# EAGLE schematic hw_LM (EAGLE 7.6.0), part 1 of 3

## Sheet 1 of 9: Connector
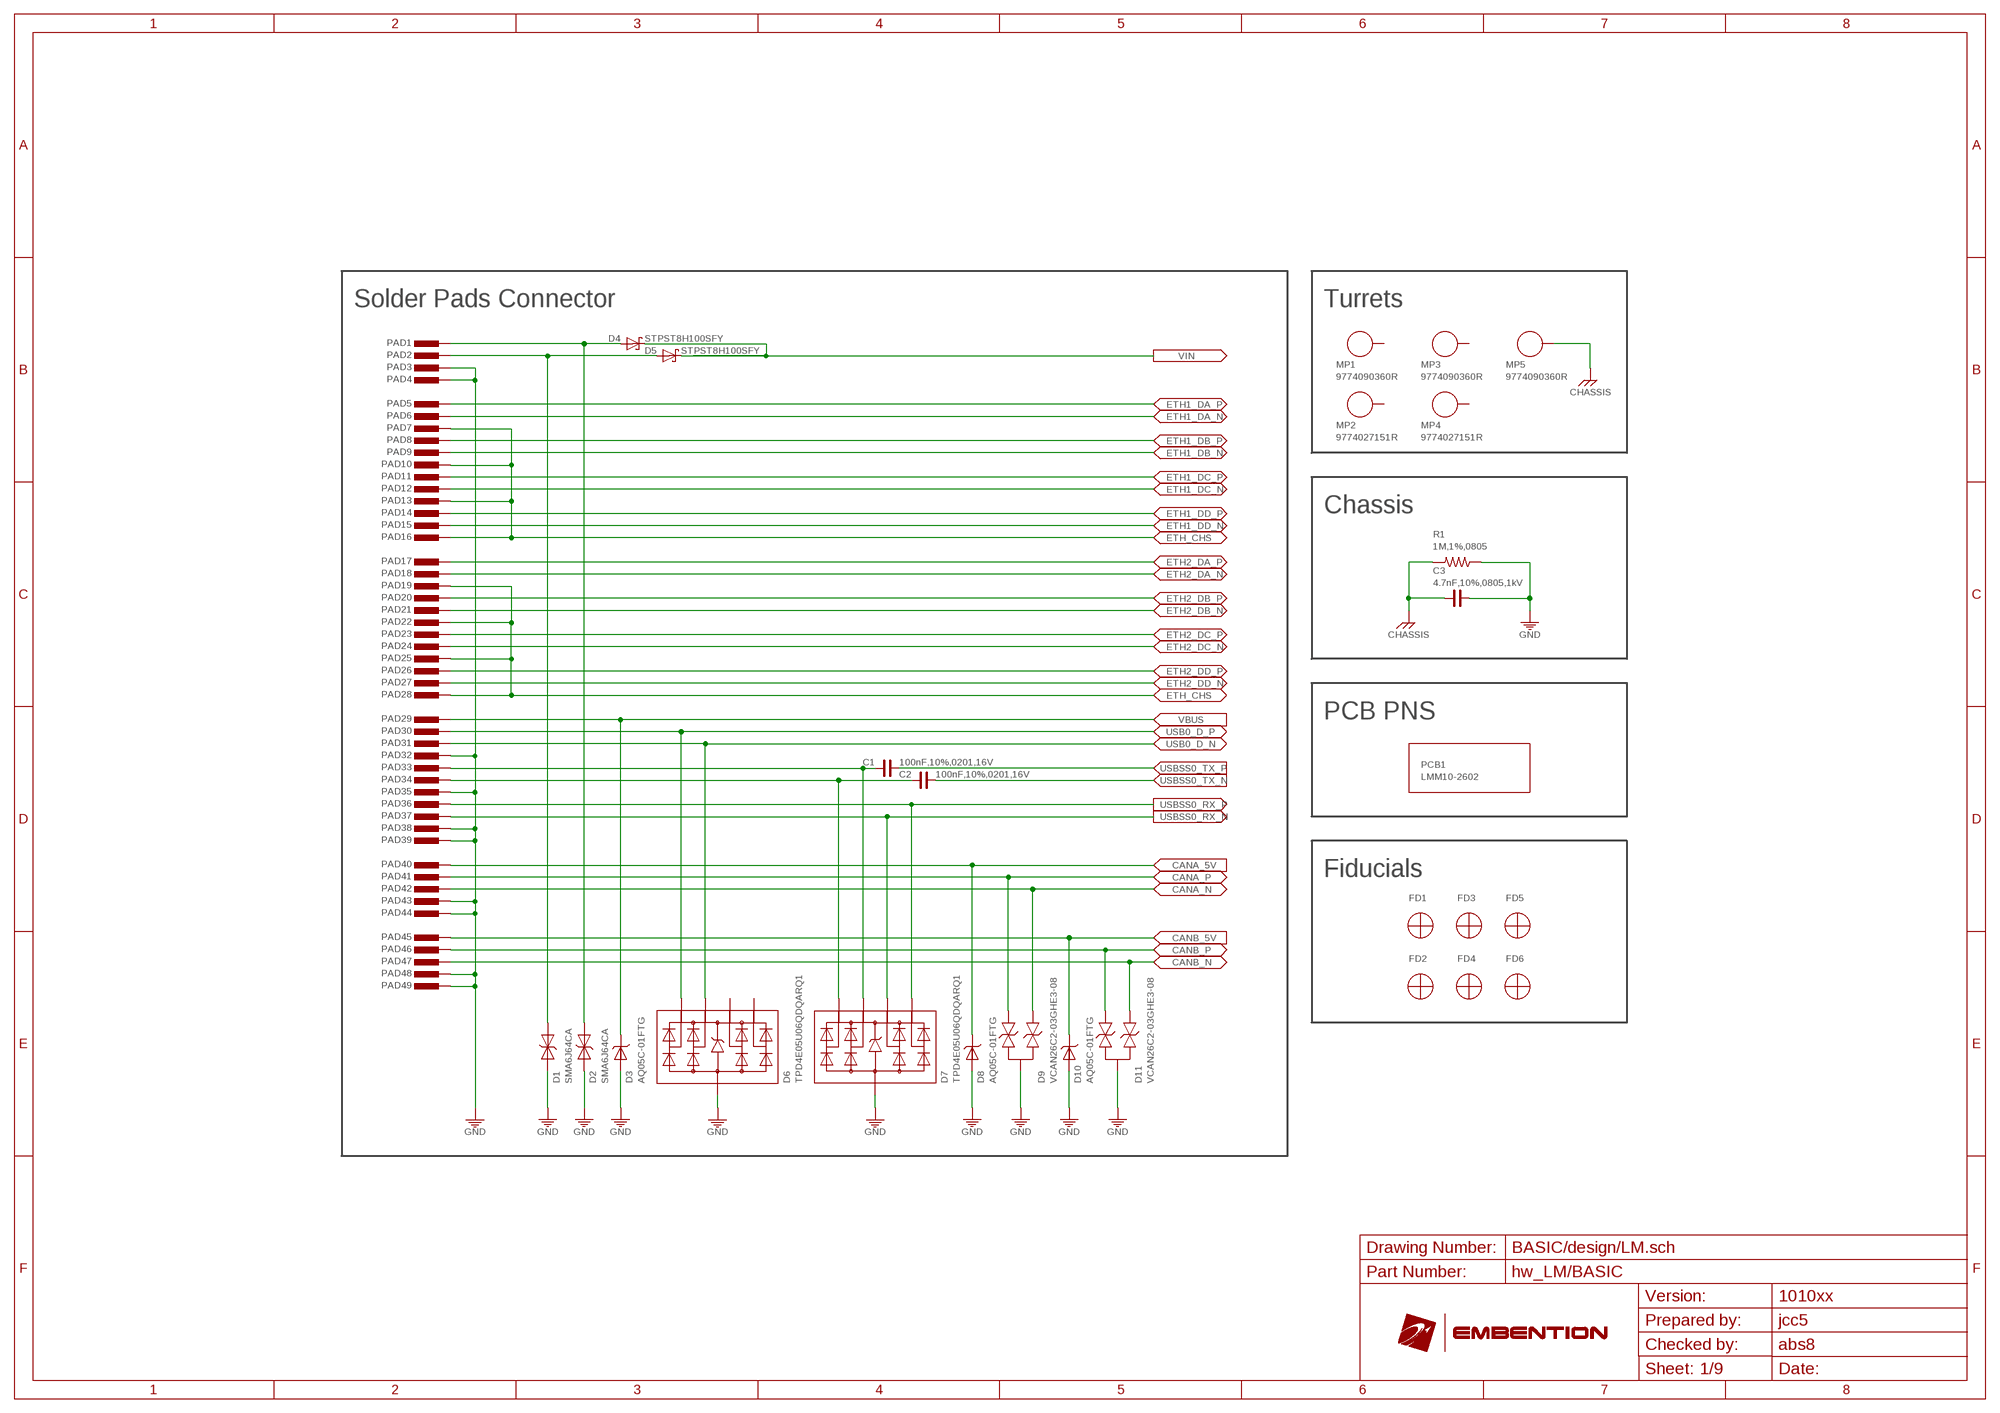
[diagram p0: schematic, sheet 1]

### Parts
C1  100nF,10%,0201,16V  C_0201  [C0201]
C2  100nF,10%,0201,16V  C_0201  [C0201]
C3  4.7nF,10%,0805,1kV  C_0805  [C0805]
D1  SMA6J64CA  SZ1SMA36CAT3G  [SMA_BI]
D2  SMA6J64CA  SZ1SMA36CAT3G  [SMA_BI]
D3  AQ05C-01FTG  AQ4020-01FTG  [SOD-323]
D4  STPST8H100SFY  [TO-277A-3]
D5  STPST8H100SFY  [TO-277A-3]
D6  TPD4E05U06QDQARQ1  [DQA(R-PUSON-N10)]
D7  TPD4E05U06QDQARQ1  [DQA(R-PUSON-N10)]
D8  AQ05C-01FTG  AQ4020-01FTG  [SOD-323]
D9  VCAN26C2-03GHE3-08  [SOT323-3]
D10  AQ05C-01FTG  AQ4020-01FTG  [SOD-323]
D11  VCAN26C2-03GHE3-08  [SOT323-3]
FD1  NOPOP  FIDUCIAL  [FIDU]
FD2  NOPOP  FIDUCIAL  [FIDU]
FD3  NOPOP  FIDUCIAL  [FIDU]
FD4  NOPOP  FIDUCIAL  [FIDU]
FD5  NOPOP  FIDUCIAL  [FIDU]
FD6  NOPOP  FIDUCIAL  [FIDU]
MP1  9774090360R  9774050360R  [9774050360R]
MP2  9774027151R  WA-SMSI_9774XXX151_9774027151R  [WA-SMSI_9774027151]
MP3  9774090360R  9774050360R  [9774050360R]
MP4  9774027151R  WA-SMSI_9774XXX151_9774027151R  [WA-SMSI_9774027151]
MP5  9774090360R  9774050360R  [9774050360R]
PAD1  NOPOP  PAD_SMD_5X1.25  [PAD_SMD_5X1.25]
PAD2  NOPOP  PAD_SMD_5X1.25  [PAD_SMD_5X1.25]
PAD3  NOPOP  PAD_SMD_5X1.25  [PAD_SMD_5X1.25]
PAD4  NOPOP  PAD_SMD_5X1.25  [PAD_SMD_5X1.25]
PAD5  NOPOP  PAD_SMD_5X0.8  [PAD_SMD_5X0.8]
PAD6  NOPOP  PAD_SMD_5X0.8  [PAD_SMD_5X0.8]
PAD7  NOPOP  PAD_SMD_5X0.8  [PAD_SMD_5X0.8]
PAD8  NOPOP  PAD_SMD_5X0.8  [PAD_SMD_5X0.8]
PAD9  NOPOP  PAD_SMD_5X0.8  [PAD_SMD_5X0.8]
PAD10  NOPOP  PAD_SMD_5X0.8  [PAD_SMD_5X0.8]
PAD11  NOPOP  PAD_SMD_5X0.8  [PAD_SMD_5X0.8]
PAD12  NOPOP  PAD_SMD_5X0.8  [PAD_SMD_5X0.8]
PAD13  NOPOP  PAD_SMD_5X0.8  [PAD_SMD_5X0.8]
PAD14  NOPOP  PAD_SMD_5X0.8  [PAD_SMD_5X0.8]
PAD15  NOPOP  PAD_SMD_5X0.8  [PAD_SMD_5X0.8]
PAD16  NOPOP  PAD_SMD_5X0.8  [PAD_SMD_5X0.8]
PAD17  NOPOP  PAD_SMD_5X0.8  [PAD_SMD_5X0.8]
PAD18  NOPOP  PAD_SMD_5X0.8  [PAD_SMD_5X0.8]
PAD19  NOPOP  PAD_SMD_5X0.8  [PAD_SMD_5X0.8]
PAD20  NOPOP  PAD_SMD_5X0.8  [PAD_SMD_5X0.8]
PAD21  NOPOP  PAD_SMD_5X0.8  [PAD_SMD_5X0.8]
PAD22  NOPOP  PAD_SMD_5X0.8  [PAD_SMD_5X0.8]
PAD23  NOPOP  PAD_SMD_5X0.8  [PAD_SMD_5X0.8]
PAD24  NOPOP  PAD_SMD_5X0.8  [PAD_SMD_5X0.8]
PAD25  NOPOP  PAD_SMD_5X0.8  [PAD_SMD_5X0.8]
PAD26  NOPOP  PAD_SMD_5X0.8  [PAD_SMD_5X0.8]
PAD27  NOPOP  PAD_SMD_5X0.8  [PAD_SMD_5X0.8]
PAD28  NOPOP  PAD_SMD_5X0.8  [PAD_SMD_5X0.8]
PAD29  NOPOP  PAD_SMD_5X1  [PAD_SMD_5X1]
PAD30  NOPOP  PAD_SMD_5X0.8  [PAD_SMD_5X0.8]
PAD31  NOPOP  PAD_SMD_5X0.8  [PAD_SMD_5X0.8]
PAD32  NOPOP  PAD_SMD_5X0.8  [PAD_SMD_5X0.8]
PAD33  NOPOP  PAD_SMD_5X0.8  [PAD_SMD_5X0.8]
PAD34  NOPOP  PAD_SMD_5X0.8  [PAD_SMD_5X0.8]
PAD35  NOPOP  PAD_SMD_5X0.8  [PAD_SMD_5X0.8]
PAD36  NOPOP  PAD_SMD_5X0.8  [PAD_SMD_5X0.8]
PAD37  NOPOP  PAD_SMD_5X0.8  [PAD_SMD_5X0.8]
PAD38  NOPOP  PAD_SMD_5X0.8  [PAD_SMD_5X0.8]
PAD39  NOPOP  PAD_SMD_5X1  [PAD_SMD_5X1]
PAD40  NOPOP  PAD_SMD_5X0.8  [PAD_SMD_5X0.8]
PAD41  NOPOP  PAD_SMD_5X0.8  [PAD_SMD_5X0.8]
PAD42  NOPOP  PAD_SMD_5X0.8  [PAD_SMD_5X0.8]
PAD43  NOPOP  PAD_SMD_5X0.8  [PAD_SMD_5X0.8]
PAD44  NOPOP  PAD_SMD_5X0.8  [PAD_SMD_5X0.8]
PAD45  NOPOP  PAD_SMD_5X0.8  [PAD_SMD_5X0.8]
PAD46  NOPOP  PAD_SMD_5X0.8  [PAD_SMD_5X0.8]
PAD47  NOPOP  PAD_SMD_5X0.8  [PAD_SMD_5X0.8]
PAD48  NOPOP  PAD_SMD_5X0.8  [PAD_SMD_5X0.8]
PAD49  NOPOP  PAD_SMD_5X0.8  [PAD_SMD_5X0.8]
PCB1  LMM10-2602  EXTERNAL-PCB-COMPONENTS  [VOID]
R1  1M,1%,0805  R_0805  [R0805]

### Nets
BAT1: D2.2 D4.A1(A) D4.A2(A) PAD1.1
BAT2: D1.2 D5.A1(A) D5.A2(A) PAD2.1
CANA_5V: D8.K PAD40.1 ; also sheet 7
CANA_N [120R]: D9.1 PAD42.1 ; also sheet 7
CANA_P [120R]: D9.2 PAD41.1 ; also sheet 7
CANB_5V: D10.K PAD45.1 ; also sheet 7
CANB_N [120R]: D11.1 PAD47.1 ; also sheet 7
CANB_P [120R]: D11.2 PAD46.1 ; also sheet 7
CHASSIS: C3.2 MP5.1 R1.2
ETH1_DA_N [100R]: PAD6.1 ; also sheet 6
ETH1_DA_P [100R]: PAD5.1 ; also sheet 6
ETH1_DB_N [100R]: PAD9.1 ; also sheet 6
ETH1_DB_P [100R]: PAD8.1 ; also sheet 6
ETH1_DC_N [100R]: PAD12.1 ; also sheet 6
ETH1_DC_P [100R]: PAD11.1 ; also sheet 6
ETH1_DD_N [100R]: PAD15.1 ; also sheet 6
ETH1_DD_P [100R]: PAD14.1 ; also sheet 6
ETH2_DA_N [100R]: PAD18.1 ; also sheet 6
ETH2_DA_P [100R]: PAD17.1 ; also sheet 6
ETH2_DB_N [100R]: PAD21.1 ; also sheet 6
ETH2_DB_P [100R]: PAD20.1 ; also sheet 6
ETH2_DC_N [100R]: PAD24.1 ; also sheet 6
ETH2_DC_P [100R]: PAD23.1 ; also sheet 6
ETH2_DD_N [100R]: PAD27.1 ; also sheet 6
ETH2_DD_P [100R]: PAD26.1 ; also sheet 6
ETH_CHS: PAD7.1 PAD10.1 PAD13.1 PAD16.1 PAD19.1 PAD22.1 PAD25.1 PAD28.1 ; also sheet 6
GND: C3.1 D1.1 D2.1 D3.A D6.3(CA) D6.8(CA) D7.3(CA) D7.8(CA) D8.A D9.3 D10.A D11.3 PAD3.1 PAD4.1 PAD32.1 PAD35.1 PAD38.1 PAD39.1 PAD43.1 PAD44.1 PAD48.1 PAD49.1 R1.1 ; also sheet 2,3,4,5,6,7,8,9
USB0_D_N [90R]: D6.2(K2) D6.9(K2) PAD31.1 ; also sheet 5
USB0_D_P [90R]: D6.1(K1) D6.10(K1) PAD30.1 ; also sheet 5
USB_TX_N [90R]: C2.2 D7.5(K4) D7.6(K4) PAD34.1
USB_TX_P [90R]: C1.2 D7.4(K3) D7.7(K3) PAD33.1
USBSS0_RX_N [90R]: D7.2(K2) D7.9(K2) PAD37.1 ; also sheet 5
USBSS0_RX_P [90R]: D7.1(K1) D7.10(K1) PAD36.1 ; also sheet 5
USBSS0_TX_N [90R]: C2.1 ; also sheet 5
USBSS0_TX_P [90R]: C1.1 ; also sheet 5
VBUS: D3.K PAD29.1 ; also sheet 5
VIN: D4.K(C) D5.K(C) ; also sheet 2
Unconnected: D6.4(K3) D6.5(K4) D6.6(K4) D6.7(K3) MP1.1 MP2.1 MP3.1 MP4.1

### Notes on the sheet
- Solder Pads Connector | Turrets
- Chassis
- PCB PNS
- Fiducials
- BASIC/design/LM.sch
- hw_LM/BASIC
- 1010xx
- jcc5
- abs8

## Sheet 2 of 9: Power Supply
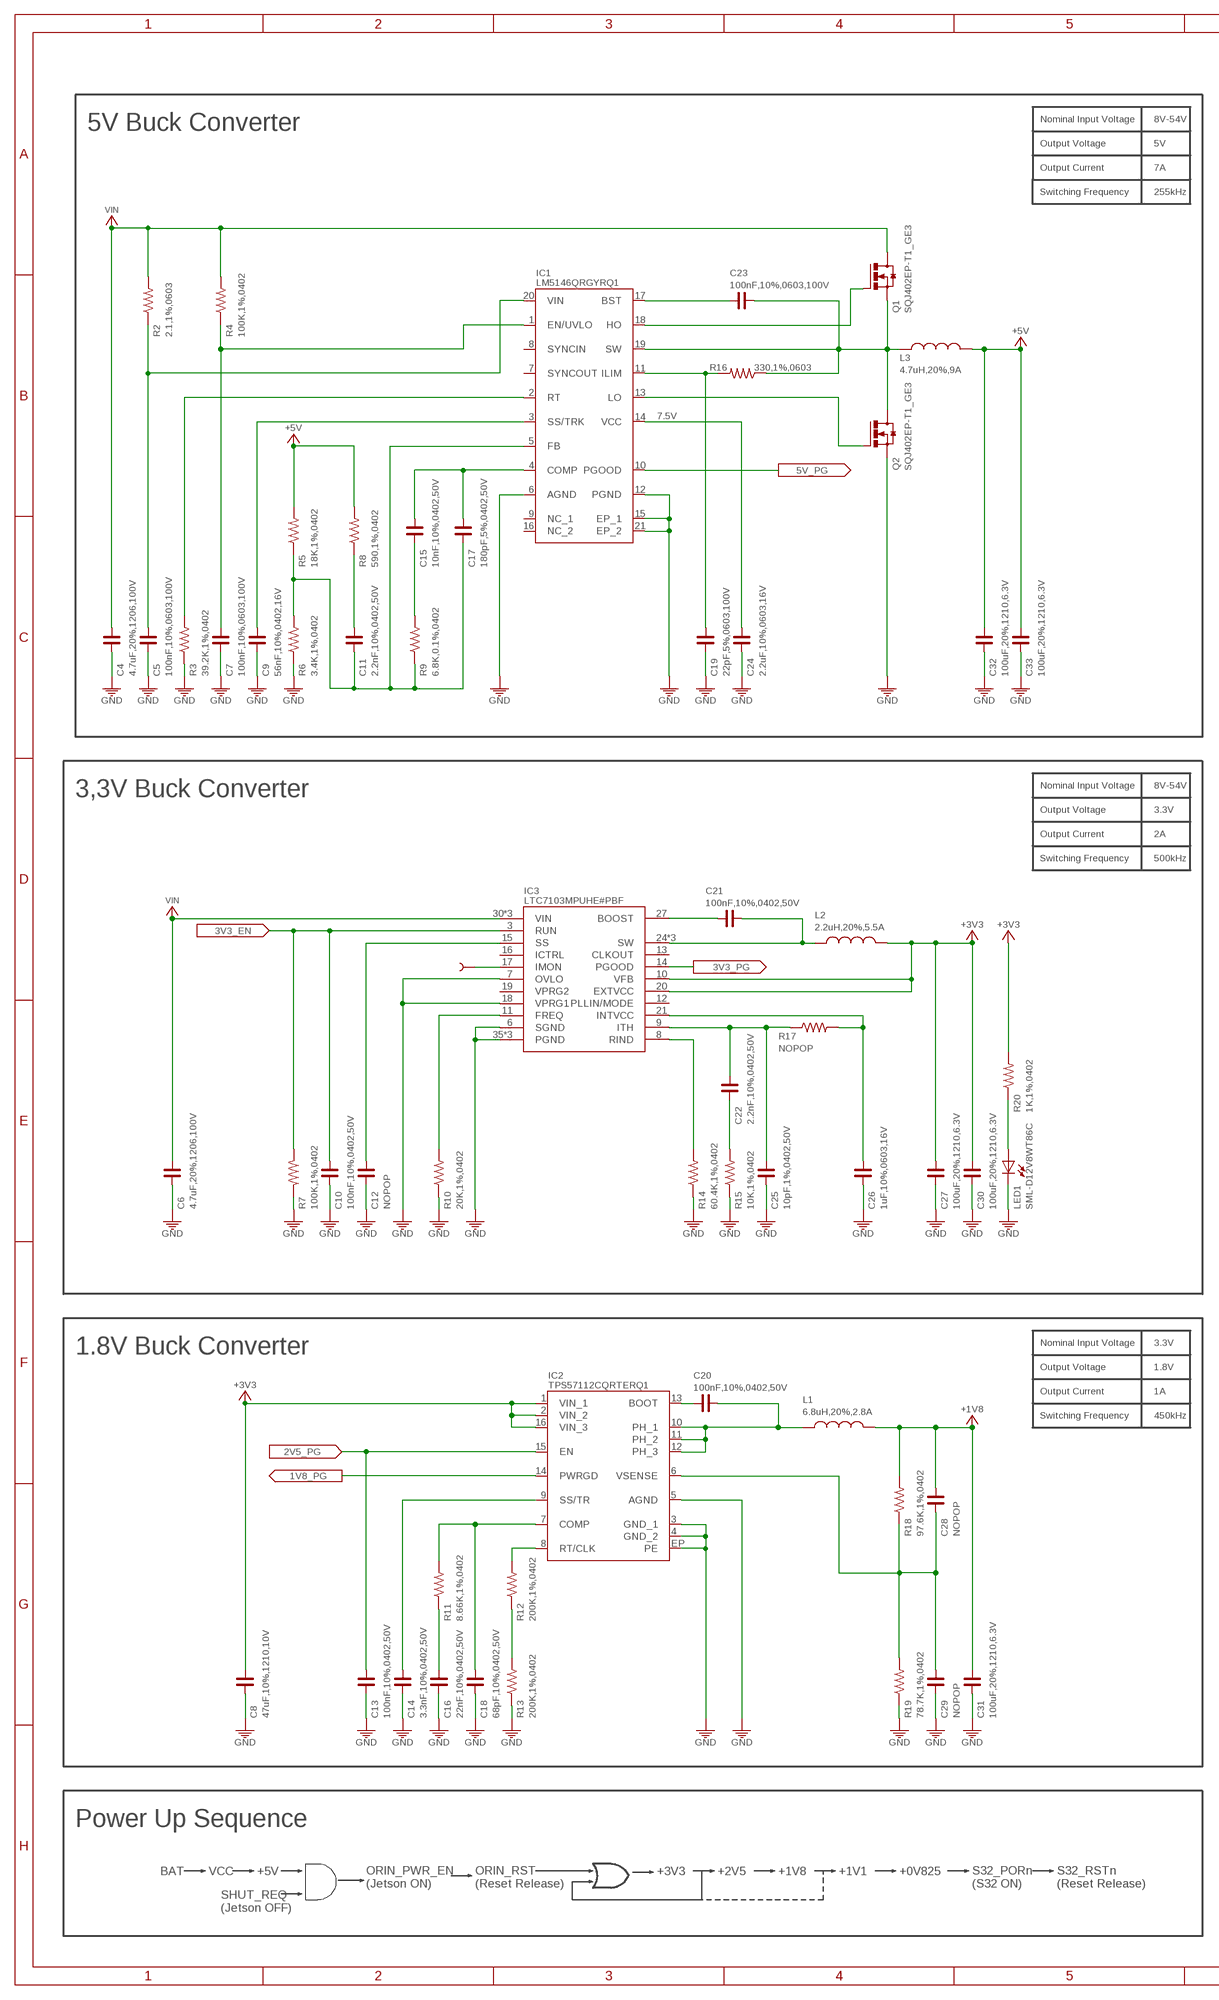
[diagram p1: schematic, sheet 2, part 1 of 2]
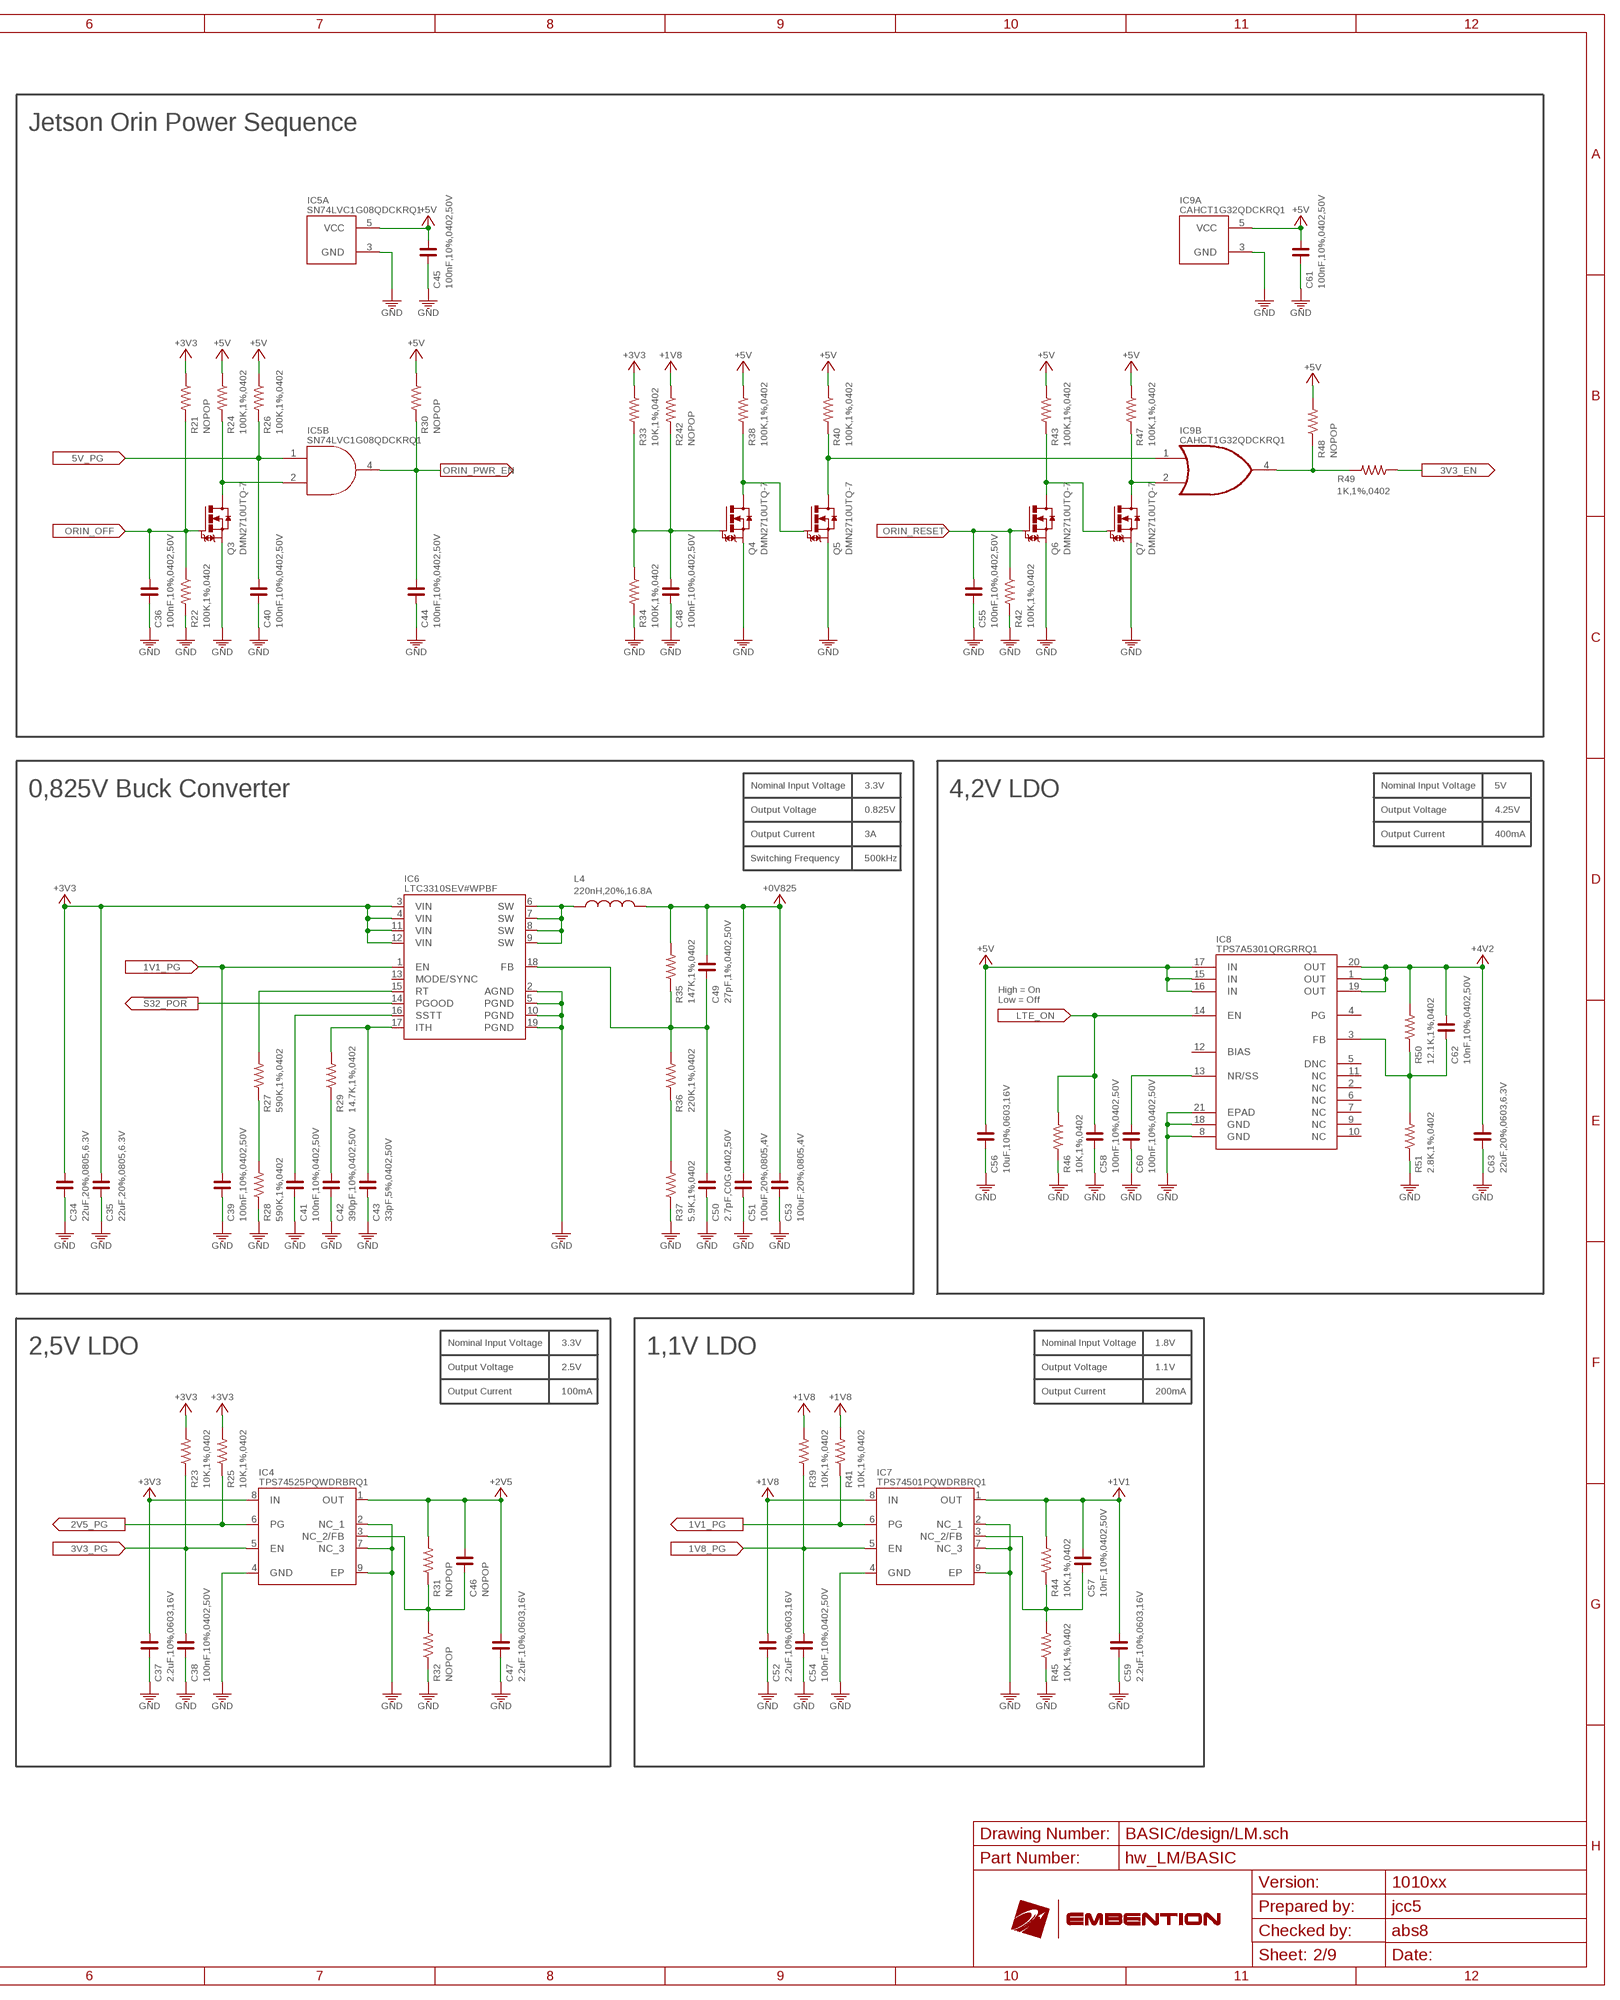
[diagram p2: schematic, sheet 2, part 2 of 2]

### Parts
C4  4.7uF,20%,1206,100V  C_1206  [C1206]
C5  100nF,10%,0603,100V  C_0603  [C0603]
C6  4.7uF,20%,1206,100V  C_1206  [C1206]
C7  100nF,10%,0603,100V  C_0603  [C0603]
C8  47uF,10%,1210,10V  C_1210  [C1210]
C9  56nF,10%,0402,16V  C_0402  [C0402]
C10  100nF,10%,0402,50V  C_0402  [C0402]
C11  2.2nF,10%,0402,50V  C_0402  [C0402]
C12  NOPOP  C_0402  [C0402]
C13  100nF,10%,0402,50V  C_0402  [C0402]
C14  3.3nF,10%,0402,50V  C_0402  [C0402]
C15  10nF,10%,0402,50V  C_0402  [C0402]
C16  22nF,10%,0402,50V  C_0402  [C0402]
C17  180pF,5%,0402,50V  C_0402  [C0402]
C18  68pF,10%,0402,50V  C_0402  [C0402]
C19  22pF,5%,0603,100V  C_0603  [C0603]
C20  100nF,10%,0402,50V  C_0402  [C0402]
C21  100nF,10%,0402,50V  C_0402  [C0402]
C22  2.2nF,10%,0402,50V  C_0402  [C0402]
C23  100nF,10%,0603,100V  C_0603  [C0603]
C24  2.2uF,10%,0603,16V  C_0603  [C0603]
C25  10pF,1%,0402,50V  C_0402  [C0402]
C26  1uF,10%,0603,16V  C_0402  [C0402]
C27  100uF,20%,1210,6.3V  C_1210  [C1210]
C28  NOPOP  C_0402  [C0402]
C29  NOPOP  C_0402  [C0402]
C30  100uF,20%,1210,6.3V  C_1210  [C1210]
C31  100uF,20%,1210,6.3V  C_1210  [C1210]
C32  100uF,20%,1210,6.3V  C_1210  [C1210]
C33  100uF,20%,1210,6.3V  C_1210  [C1210]
C34  22uF,20%,0805,6.3V  C_0805  [C0805]
C35  22uF,20%,0805,6.3V  C_0805  [C0805]
C36  100nF,10%,0402,50V  C_0402  [C0402]
C37  2.2uF,10%,0603,16V  C_0603  [C0603]
C38  100nF,10%,0402,50V  C_0402  [C0402]
C39  100nF,10%,0402,50V  C_0402  [C0402]
C40  100nF,10%,0402,50V  C_0402  [C0402]
C41  100nF,10%,0402,50V  C_0402  [C0402]
C42  390pF,10%,0402,50V  C_0402  [C0402]
C43  33pF,5%,0402,50V  C_0402  [C0402]
C44  100nF,10%,0402,50V  C_0402  [C0402]
C45  100nF,10%,0402,50V  C_0402  [C0402]
C46  NOPOP  C_0402  [C0402]
C47  2.2uF,10%,0603,16V  C_0603  [C0603]
C48  100nF,10%,0402,50V  C_0402  [C0402]
C49  27pF,1%,0402,50V  C_0402  [C0402]
C50  2.7pF,C0G,0402,50V  C_0402  [C0402]
C51  100uF,20%,0805,4V  C_0805  [C0805]
C52  2.2uF,10%,0603,16V  C_0603  [C0603]
C53  100uF,20%,0805,4V  C_0805  [C0805]
C54  100nF,10%,0402,50V  C_0402  [C0402]
C55  100nF,10%,0402,50V  C_0402  [C0402]
C56  10uF,10%,0603,16V  C_0603  [C0603]
C57  10nF,10%,0402,50V  C_0402  [C0402]
C58  100nF,10%,0402,50V  C_0402  [C0402]
C59  2.2uF,10%,0603,16V  C_0603  [C0603]
C60  100nF,10%,0402,50V  C_0402  [C0402]
C61  100nF,10%,0402,50V  C_0402  [C0402]
C62  10nF,10%,0402,50V  C_0402  [C0402]
C63  22uF,20%,0603,6.3V  C_0603  [C0603]
IC1  LM5146QRGYRQ1  LM5146-Q1  [VQFN-20]
IC2  TPS57112CQRTERQ1  TPS57112C-Q1  [WQFN-16]
IC3  LTC7103MPUHE#PBF  LTC7103IUHE  [UHE36(26)]
IC4  TPS74525PQWDRBRQ1  TPS745-Q1  [VSON-8]
IC5  SN74LVC1G08QDCKRQ1  [DCK5]
IC6  LTC3310SEV#WPBF  LTC3310S  [LQFN-18]
IC7  TPS74501PQWDRBRQ1  TPS745-Q1  [VSON-8]
IC8  TPS7A5301QRGRRQ1  TPS7A5201QRGRRQ1  [VQFN-20(TEXAS)]
IC9  CAHCT1G32QDCKRQ1  SN74AHCT1G32Q1  [DCK5]
L1  6.8uH,20%,2.8A  IHLP2020CZER220M11  [IHLP2020CZER220M11]
L2  2.2uH,20%,5.5A  XAL4020  [XAL4020]
L3  4.7uH,20%,9A  XAL7030472  [XAL7030-472]
L4  220nH,20%,16.8A  XAL4020  [XAL4020]
LED1  SML-D12V8WT86C  LED0603  [LED-0603]
Q1  SQJ402EP-T1_GE3  [SO-8L]
Q2  SQJ402EP-T1_GE3  [SO-8L]
Q3  DMN2710UTQ-7  [SOT-523]
Q4  DMN2710UTQ-7  [SOT-523]
Q5  DMN2710UTQ-7  [SOT-523]
Q6  DMN2710UTQ-7  [SOT-523]
Q7  DMN2710UTQ-7  [SOT-523]
R2  2.1,1%,0603  R_0603  [R0603]
R3  39.2K,1%,0402  R_0402  [R0402]
R4  100K,1%,0402  R_0402  [R0402]
R5  18K,1%,0402  R_0402  [R0402]
R6  3.4K,1%,0402  R_0402  [R0402]
R7  100K,1%,0402  R_0402  [R0402]
R8  590,1%,0402  R_0402  [R0402]
R9  6.8K,0.1%,0402  R_0402  [R0402]
R10  20K,1%,0402  R_0402  [R0402]
R11  8.66K,1%,0402  R_0402  [R0402]
R12  200K,1%,0402  R_0402  [R0402]
R13  200K,1%,0402  R_0402  [R0402]
R14  60.4K,1%,0402  R_0402  [R0402]
R15  10K,1%,0402  R_0402  [R0402]
R16  330,1%,0603  R_0603  [R0603]
R17  NOPOP  R_0402  [R0402]
R18  97.6K,1%,0402  R_0402  [R0402]
R19  78.7K,1%,0402  R_0402  [R0402]
R20  1K,1%,0402  R_0402  [R0402]
R21  NOPOP  R_0402  [R0402]
R22  100K,1%,0402  R_0402  [R0402]
R23  10K,1%,0402  R_0402  [R0402]
R24  100K,1%,0402  R_0402  [R0402]
R25  10K,1%,0402  R_0402  [R0402]
R26  100K,1%,0402  R_0402  [R0402]
R27  590K,1%,0402  R_0402  [R0402]
R28  590K,1%,0402  R_0402  [R0402]
R29  14.7K,1%,0402  R_0402  [R0402]
R30  NOPOP  R_0402  [R0402]
R31  NOPOP  R_0402  [R0402]
R32  NOPOP  R_0402  [R0402]
R33  10K,1%,0402  R_0402  [R0402]
R34  100K,1%,0402  R_0402  [R0402]
R35  147K,1%,0402  R_0402  [R0402]
R36  220K,1%,0402  R_0402  [R0402]
R37  5.9K,1%,0402  R_0402  [R0402]
R38  100K,1%,0402  R_0402  [R0402]
R39  10K,1%,0402  R_0402  [R0402]
R40  100K,1%,0402  R_0402  [R0402]
R41  10K,1%,0402  R_0402  [R0402]
R42  100K,1%,0402  R_0402  [R0402]
R43  100K,1%,0402  R_0402  [R0402]
R44  10K,1%,0402  R_0402  [R0402]
R45  10K,1%,0402  R_0402  [R0402]
R46  10K,1%,0402  R_0402  [R0402]
R47  100K,1%,0402  R_0402  [R0402]
R48  NOPOP  R_0402  [R0402]
R49  1K,1%,0402  R_0402  [R0402]
R50  12.1K,1%,0402  R_0402  [R0402]
R51  2.8K,1%,0402  R_0402  [R0402]
R242  NOPOP  R_0402  [R0402]
TP1  NOPOP  TEST-POINT2  [PAD.02X.02]

### Nets
0V825_FB: C49.1 C50.2 IC6.18(FB) R35.1 R36.2
0V825_ITH: C43.2 IC6.17(ITH) R29.2
0V825_RT: IC6.15(RT) R27.2
0V825_SSTT: C41.2 IC6.16(SSTT)
1V1_FB: C57.1 IC7.3(NC_2/FB) R44.1 R45.2
1V1_PG: C39.2 IC6.1(EN) IC7.6(PG) R41.1
1V8_BOOT: C20.2 IC2.13(BOOT)
1V8_COMP: C18.1 IC2.7(COMP) R11.2
1V8_PG: C54.2 IC2.14(PWRGD) IC7.5(EN) R39.1
1V8_PH: C20.1 IC2.10(PH_1) IC2.11(PH_2) IC2.12(PH_3) L1.P$1
1V8_RT: IC2.8(RT/CLK) R12.2
1V8_SS: C14.1 IC2.9(SS/TR)
1V8_VSENSE: C28.2 C29.1 IC2.6(VSENSE) R18.1 R19.2
2V5_FB: C46.2 IC4.3(NC_2/FB) R31.1 R32.2
2V5_PG: C13.2 IC2.15(EN) IC4.6(PG) R25.1
3V3_BST: C21.1 IC3.27(BOOST)
3V3_EN: C10.2 IC3.3(RUN) R7.1 R49.1
3V3_FREQ: IC3.11(FREQ) R10.2
3V3_IMON: IC3.17(IMON) TP1.P$1
3V3_INTVCC: C26.2 IC3.21(INTVCC) R17.2
3V3_ITH: C22.2 C25.2 IC3.9(ITH) R17.1
3V3_PG: C38.2 IC3.14(PGOOD) IC4.5(EN) R23.1
3V3_RIND: IC3.8(RIND) R14.2
3V3_SS: C12.2 IC3.15(SS)
3V3_SW: C21.2 IC3.24(SW) IC3.25(SW) IC3.26(SW) L2.1
4V2_FB: C62.1 IC8.3(FB) R50.1 R51.2
4V2_SS: C60.2 IC8.13(NR/SS)
5V_BST: C23.2 IC1.17(BST)
5V_COMP: C15.1 C17.1 IC1.4(COMP)
5V_EN: C7.1 IC1.1(EN/UVLO) R4.1
5V_FB: C11.2 C17.2 IC1.5(FB) R5.1 R6.2 R9.1
5V_HO: IC1.18(HO) Q1.4(G)
5V_ILIM: C19.1 IC1.11(ILIM) R16.2
5V_LO: IC1.13(LO) Q2.4(G)
5V_PG: C40.2 IC1.10(PGOOD) IC5.1(B:A) R26.2
5V_RT: IC1.2(RT) R3.2
5V_SS: C9.1 IC1.3(SS/TRK)
5V_SW: C23.1 IC1.19(SW) L3.1 Q1.1(S) Q1.2(S) Q1.3(S) Q2.5(D) Q2.EP1(D) Q2.EP2(D) R16.1
5V_VCC: C24.1 IC1.14(VCC)
5V_VIN: C5.1 IC1.20(VIN) R2.1
!S32_POR: IC6.14(PGOOD) ; also sheet 4
+0V825: C49.2 C51.2 C53.2 L4.2 R35.2 ; also sheet 3,4
+1V1: C57.2 C59.1 IC7.1(OUT) R44.2 ; also sheet 3,4,6
+1V8: C28.1 C31.2 C52.1 IC7.8(IN) L1.P$2 R18.2 R39.2 R41.2 R242.1 ; also sheet 3,4,5,6
+2V5: C46.1 C47.1 IC4.1(OUT) R31.2 ; also sheet 4,6
+3V3: C8.1 C27.2 C30.2 C34.2 C35.2 C37.1 IC2.1(VIN_1) IC2.2(VIN_2) IC2.16(VIN_3) IC3.10(VFB) IC3.20(EXTVCC) IC4.8(IN) IC6.3(VIN) IC6.4(VIN) IC6.11(VIN) IC6.12(VIN) L2.2 R20.2 R21.1 R23.2 R25.2 R33.1 ; also sheet 3,4,5,7,8,9
+4V2: C62.2 C63.2 IC8.1(OUT) IC8.19(OUT) IC8.20(OUT) R50.2 ; also sheet 4,8
+5V: C32.2 C33.2 C45.2 C56.2 C61.2 IC5.5(A:VCC) IC8.15(IN) IC8.16(IN) IC8.17(IN) IC9.5(A:VCC) L3.2 R5.2 R8.2 R24.1 R26.1 R30.1 R38.1 R40.1 R43.1 R47.1 R48.2 ; also sheet 4,5,7,8
GND: C4.2 C5.2 C6.2 C7.2 C8.2 C9.2 C10.1 C12.1 C13.1 C14.2 C16.2 C18.2 C19.2 C24.2 C25.1 C26.1 C27.1 C29.2 C30.1 C31.1 C32.1 C33.1 C34.1 C35.1 C36.1 C37.2 C38.1 C39.1 C40.1 C41.1 C42.1 C43.1 C44.1 C45.1 C47.2 C48.1 C50.1 C51.1 C52.2 C53.1 C54.1 C55.1 C56.1 C58.1 C59.2 C60.1 C61.1 C63.1 IC1.6(AGND) IC1.12(PGND) IC1.15(EP_1) IC1.21(EP_2) IC2.3(GND_1) IC2.4(GND_2) IC2.5(AGND) IC2.EP(PE) IC3.6(SGND) IC3.7(OVLO) IC3.18(VPRG1) IC3.35(PGND) IC3.36(PGND) IC3.37(PGND) IC4.2(NC_1) IC4.4(GND) IC4.7(NC_3) IC4.9(EP) IC5.3(A:GND) IC6.2(AGND) IC6.5(PGND) IC6.10(PGND) IC6.19(PGND) IC7.2(NC_1) IC7.4(GND) IC7.7(NC_3) IC7.9(EP) IC8.8(GND) IC8.18(GND) IC8.21(EPAD) IC9.3(A:GND) LED1.C Q2.1(S) Q2.2(S) Q2.3(S) Q3.2(S) Q4.2(S) Q5.2(S) Q6.2(S) Q7.2(S) R3.1 R6.1 R7.2 R10.1 R13.1 R14.1 R15.1 R19.1 R22.2 R28.1 R32.1 R34.2 R37.1 R42.2 R45.1 R46.2 R51.1 ; also sheet 1,3,4,5,6,7,8,9
LTE_ON: C58.2 IC8.14(EN) R46.1 ; also sheet 4
N$1: C48.2 Q4.1(G) R33.2 R34.1 R242.2
N$4: IC9.1(B:A) Q5.3(D) R40.2
N$5: R12.1 R13.2
N$8: Q4.3(D) Q5.1(G) R38.2
N$36: Q6.3(D) Q7.1(G) R43.2
N$37: IC9.2(B:B) Q7.3(D) R47.2
N$49: C15.2 R9.2
N$59: C42.2 R29.1
N$62: R36.1 R37.2
N$66: C11.1 R8.1
N$67: IC6.6(SW) IC6.7(SW) IC6.8(SW) IC6.9(SW) L4.1
N$73: R27.1 R28.2
N$95: IC9.4(B:Y) R48.1 R49.2
N$96: C22.1 R15.2
N$133: C16.1 R11.1
N$437: LED1.A R20.1
ORIN_OFF: C36.2 Q3.1(G) R21.2 R22.1 ; also sheet 4
ORIN_OFF_N: IC5.2(B:B) Q3.3(D) R24.2
ORIN_PWR_EN: C44.2 IC5.4(B:Y) R30.2 ; also sheet 5
ORIN_RESET: C55.2 Q6.1(G) R42.1 ; also sheet 5
VIN: C4.1 C6.1 IC3.30(VIN) IC3.31(VIN) IC3.32(VIN) Q1.5(D) Q1.EP1(D) Q1.EP2(D) R2.2 R4.2 ; also sheet 1
Unconnected: IC1.7(SYNCOUT) IC1.8(SYNCIN) IC1.9(NC_1) IC1.16(NC_2) IC3.12(PLLIN/MODE) IC3.13(CLKOUT) IC3.16(ICTRL) IC3.19(VPRG2) IC6.13(MODE/SYNC) IC8.2(NC) IC8.4(PG) IC8.5(DNC) IC8.6(NC) IC8.7(NC) IC8.9(NC) IC8.10(NC) IC8.11(NC) IC8.12(BIAS)

### Notes on the sheet
- Nominal Input Voltage | 8V-54V
- 5V Buck Converter | Jetson Orin Power Sequence
- Output Voltage | 5V
- Output Current | 7A
- Switching Frequency | 255kHz
- 7.5V
- Nominal Input Voltage | 8V-54V | Nominal Input Voltage | 3.3V | Nominal Input Voltage | 5V
- 3,3V Buck Converter | 0,825V Buck Converter | 4,2V LDO
- Output Voltage | 3.3V | Output Voltage | 0.825V | Output Voltage | 4.25V
- Output Current | 2A | Output Current | 3A | Output Current | 400mA
- Switching Frequency | 500kHz | Switching Frequency | 500kHz
- High = On
  Low = Off
- Nominal Input Voltage | 3.3V | Nominal Input Voltage | 3.3V | Nominal Input Voltage | 1.8V
- 1.8V Buck Converter | 2,5V LDO | 1,1V LDO
- Output Voltage | 1.8V | Output Voltage | 2.5V | Output Voltage | 1.1V
- Output Current | 1A | Output Current | 100mA | Output Current | 200mA
- Switching Frequency | 450kHz
- Power Up Sequence
- BASIC/design/LM.sch
- hw_LM/BASIC
- BAT | VCC | +5V | +3V3 | +2V5 | +1V8 | +1V1 | +0V825
- ORIN_PWR_EN
  (Jetson ON)
- ORIN_RST
  (Reset Release)
- S32_PORn
  (S32 ON)
- S32_RSTn
  (Reset Release)
- 1010xx
- SHUT_REQ
  (Jetson OFF)
- jcc5
- abs8

## Sheet 3 of 9: S32 Power
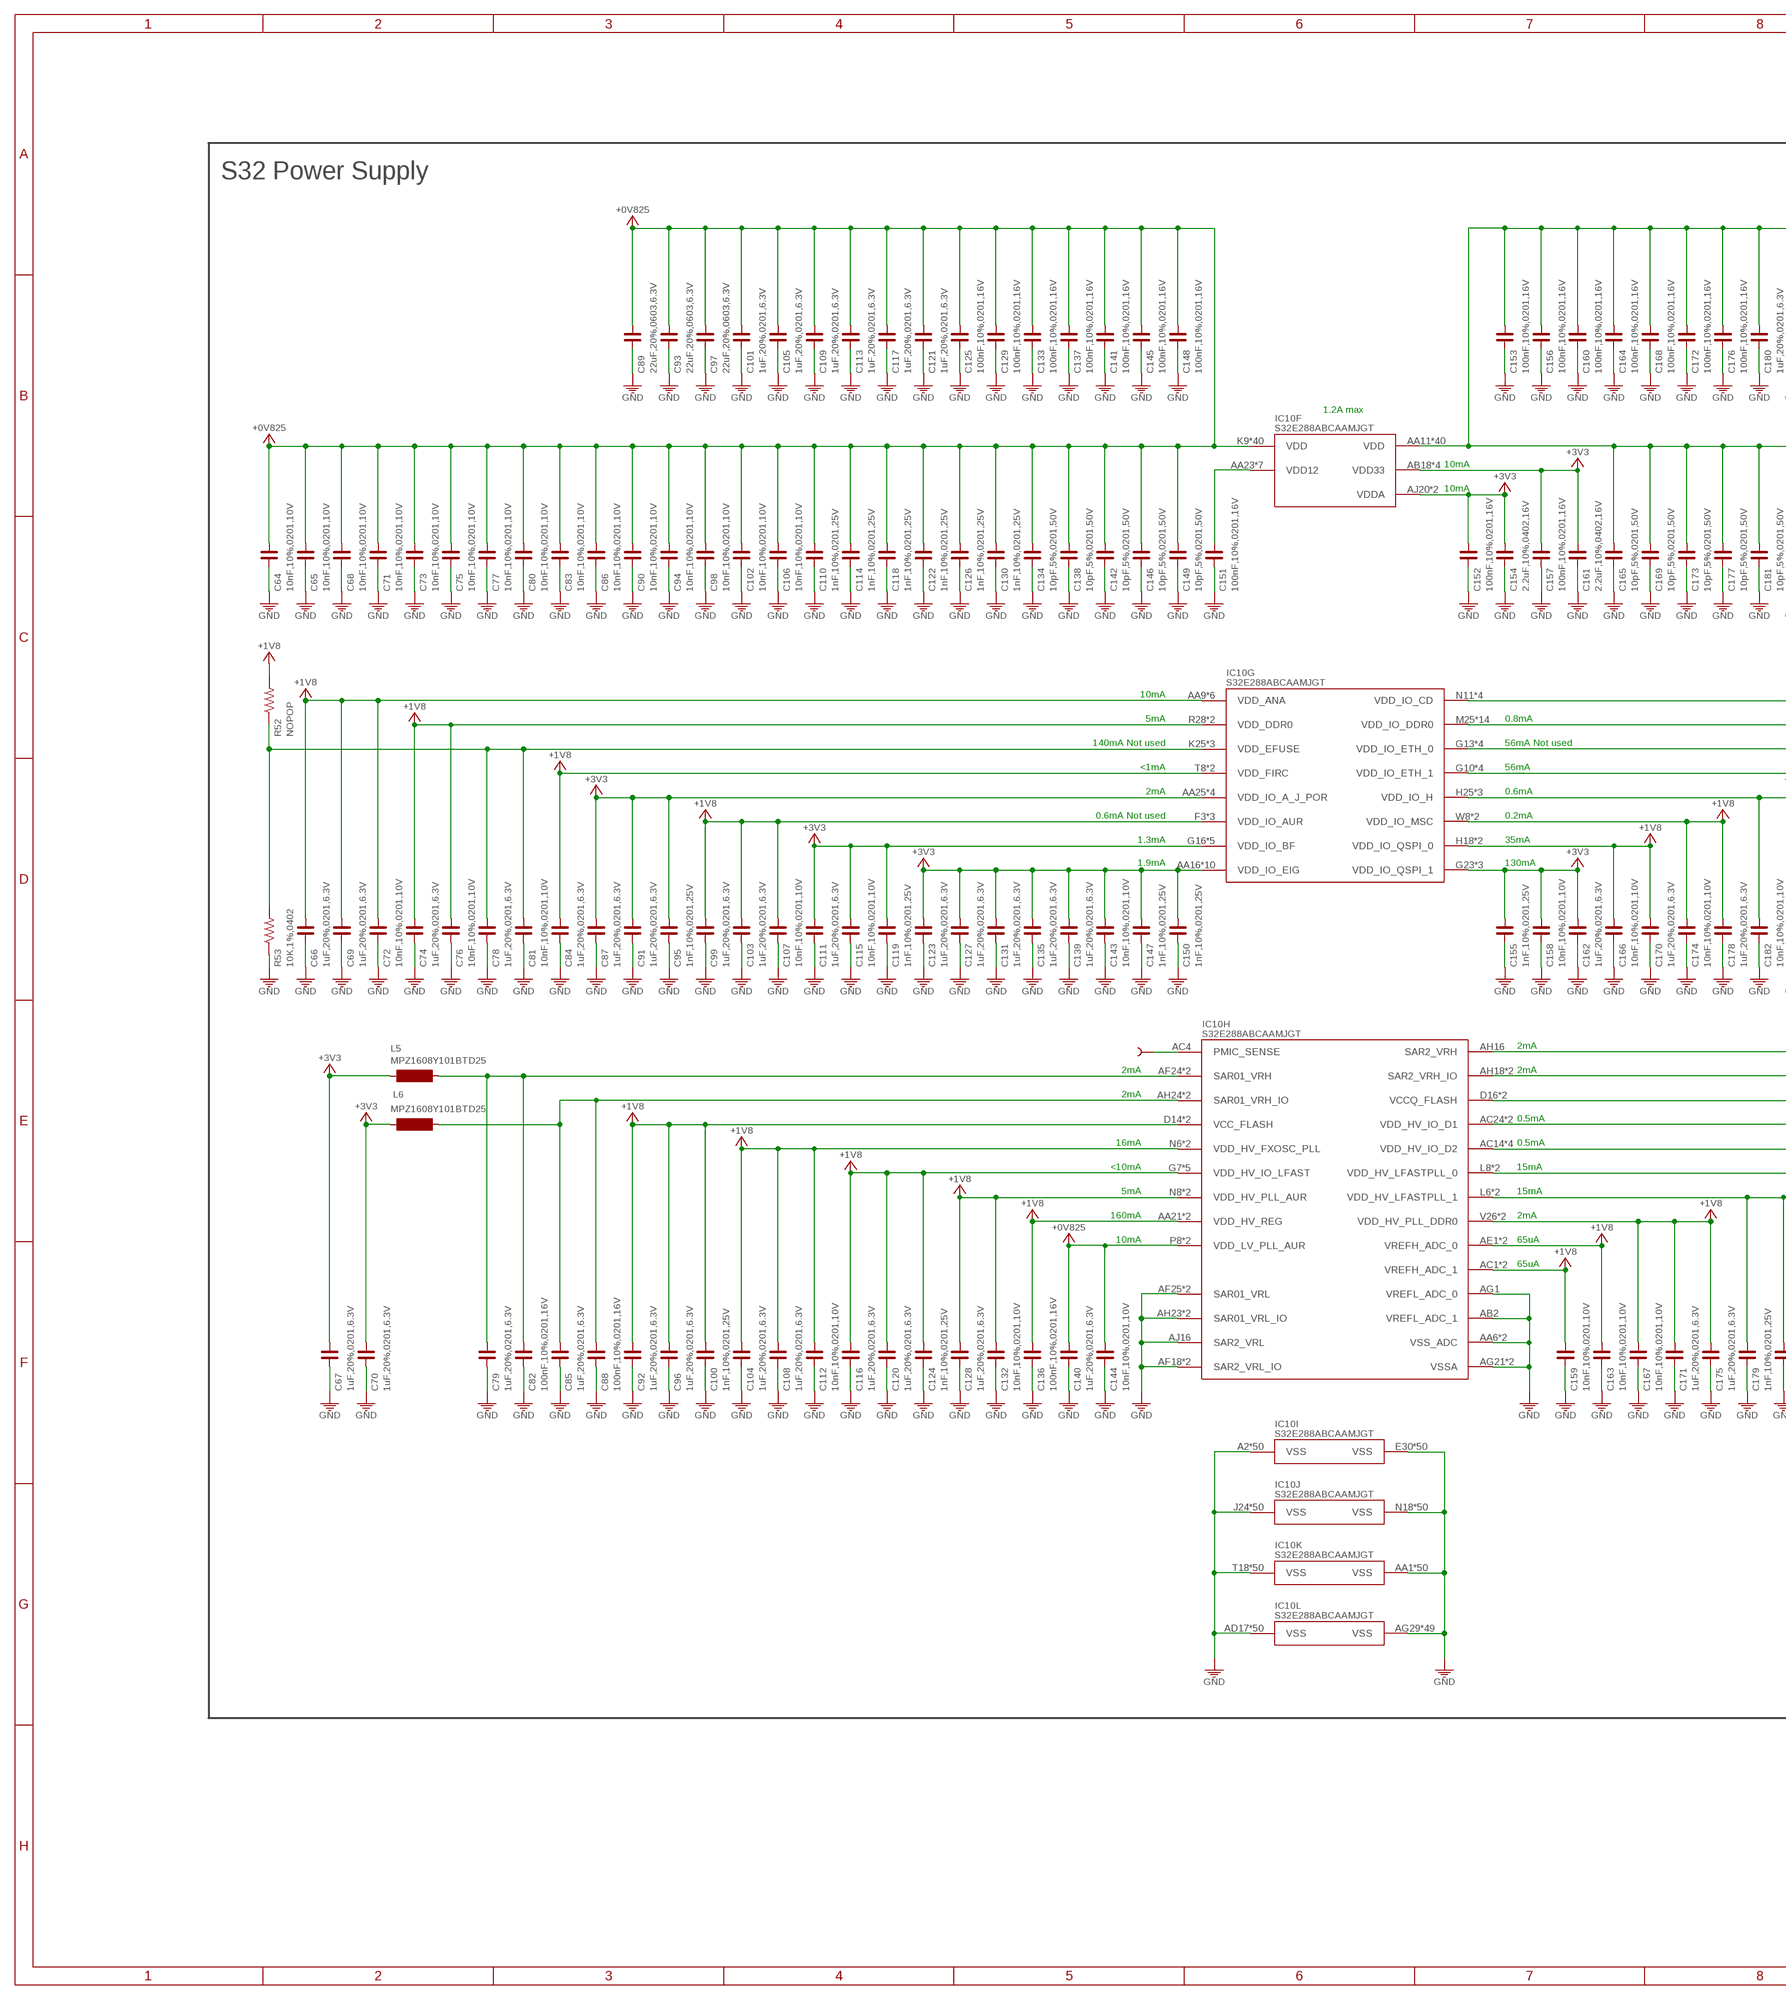
[diagram p3: schematic, sheet 3, part 1 of 2]
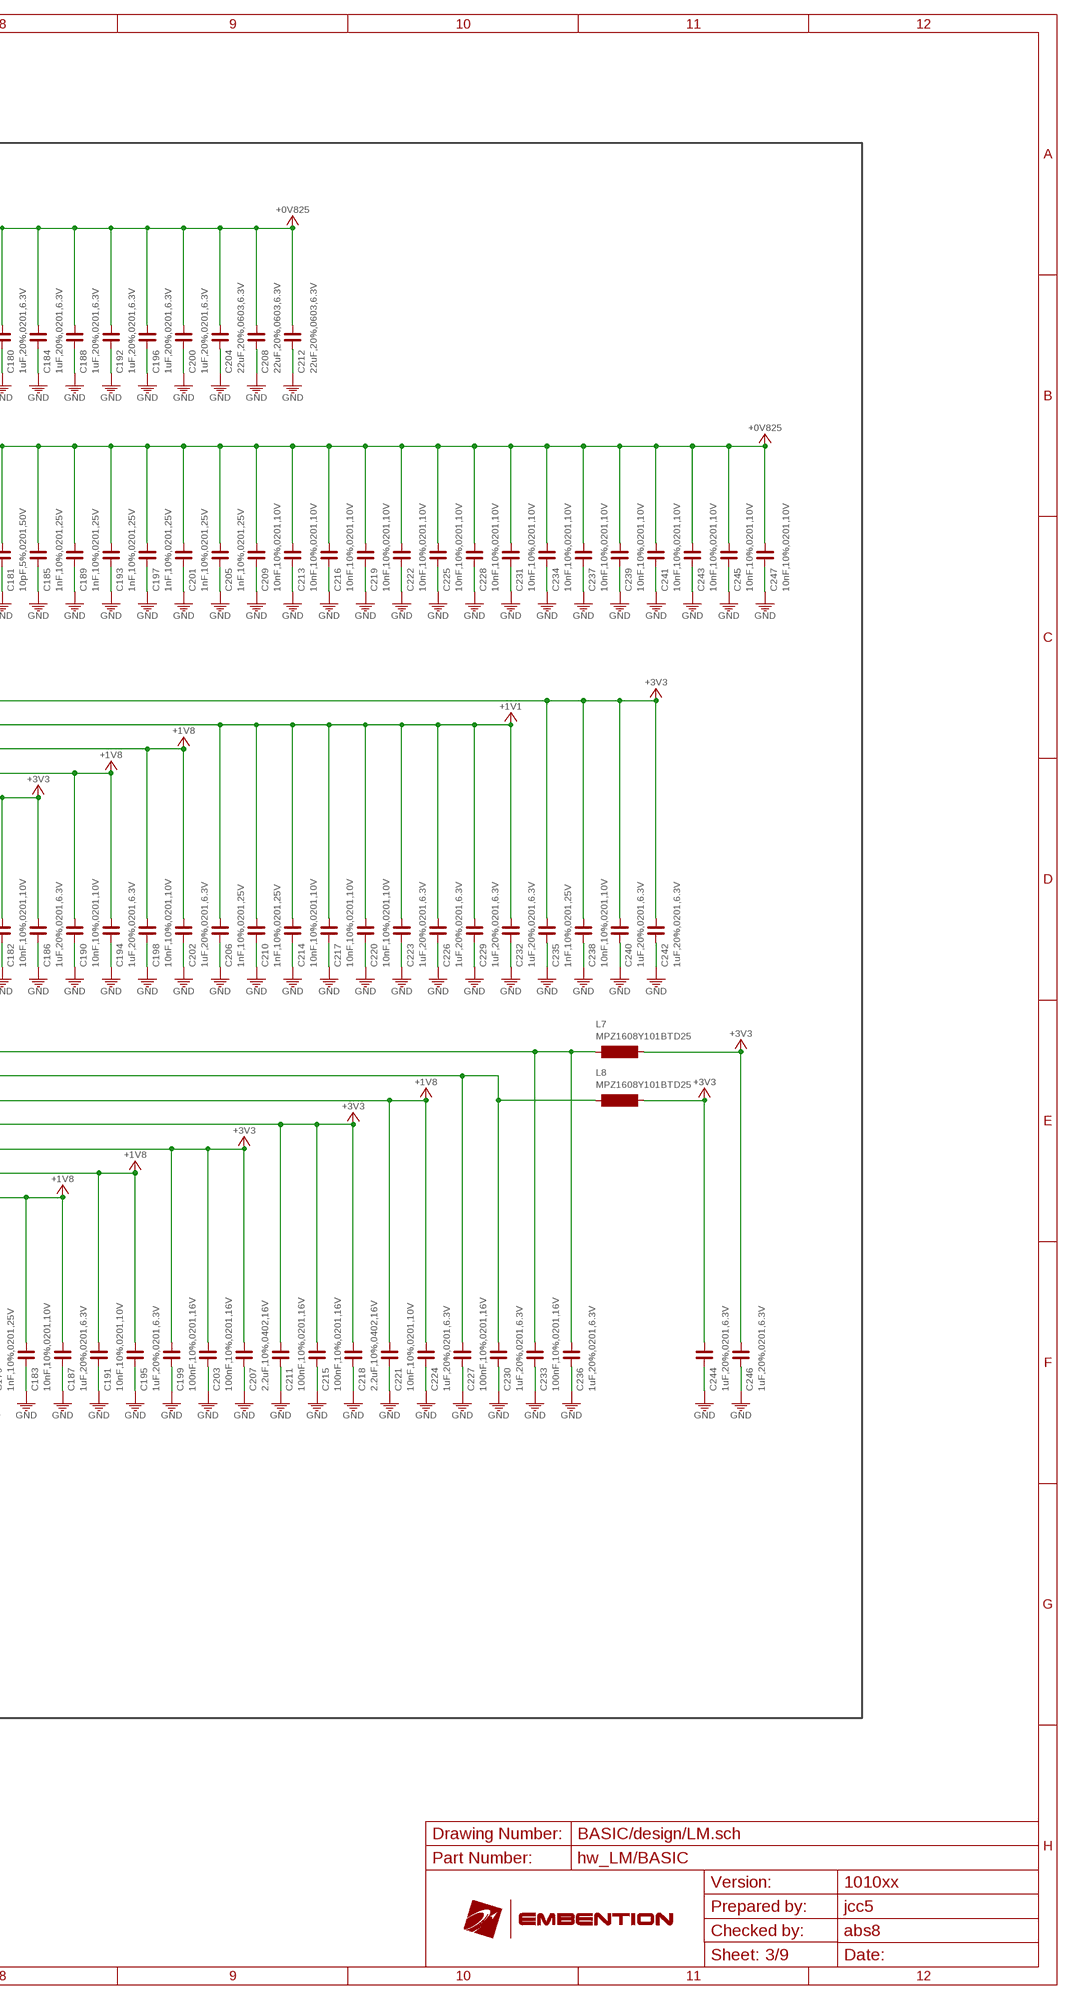
[diagram p4: schematic, sheet 3, part 2 of 2]

### Parts
C64  10nF,10%,0201,10V  C_0201  [C0201]
C65  10nF,10%,0201,10V  C_0201  [C0201]
C66  1uF,20%,0201,6.3V  C_0201  [C0201]
C67  1uF,20%,0201,6.3V  C_0201  [C0201]
C68  10nF,10%,0201,10V  C_0201  [C0201]
C69  1uF,20%,0201,6.3V  C_0201  [C0201]
C70  1uF,20%,0201,6.3V  C_0201  [C0201]
C71  10nF,10%,0201,10V  C_0201  [C0201]
C72  10nF,10%,0201,10V  C_0201  [C0201]
C73  10nF,10%,0201,10V  C_0201  [C0201]
C74  1uF,20%,0201,6.3V  C_0201  [C0201]
C75  10nF,10%,0201,10V  C_0201  [C0201]
C76  10nF,10%,0201,10V  C_0201  [C0201]
C77  10nF,10%,0201,10V  C_0201  [C0201]
C78  1uF,20%,0201,6.3V  C_0201  [C0201]
C79  1uF,20%,0201,6.3V  C_0201  [C0201]
C80  10nF,10%,0201,10V  C_0201  [C0201]
C81  10nF,10%,0201,10V  C_0201  [C0201]
C82  100nF,10%,0201,16V  C_0201  [C0201]
C83  10nF,10%,0201,10V  C_0201  [C0201]
C84  1uF,20%,0201,6.3V  C_0201  [C0201]
C85  1uF,20%,0201,6.3V  C_0201  [C0201]
C86  10nF,10%,0201,10V  C_0201  [C0201]
C87  1uF,20%,0201,6.3V  C_0201  [C0201]
C88  100nF,10%,0201,16V  C_0201  [C0201]
C89  22uF,20%,0603,6.3V  C_0603  [C0603]
C90  10nF,10%,0201,10V  C_0201  [C0201]
C91  1uF,20%,0201,6.3V  C_0201  [C0201]
C92  1uF,20%,0201,6.3V  C_0201  [C0201]
C93  22uF,20%,0603,6.3V  C_0603  [C0603]
C94  10nF,10%,0201,10V  C_0201  [C0201]
C95  1nF,10%,0201,25V  C_0201  [C0201]
C96  1uF,20%,0201,6.3V  C_0201  [C0201]
C97  22uF,20%,0603,6.3V  C_0603  [C0603]
C98  10nF,10%,0201,10V  C_0201  [C0201]
C99  1uF,20%,0201,6.3V  C_0201  [C0201]
C100  1nF,10%,0201,25V  C_0201  [C0201]
C101  1uF,20%,0201,6.3V  C_0201  [C0201]
C102  10nF,10%,0201,10V  C_0201  [C0201]
C103  1uF,20%,0201,6.3V  C_0201  [C0201]
C104  1uF,20%,0201,6.3V  C_0201  [C0201]
C105  1uF,20%,0201,6.3V  C_0201  [C0201]
C106  10nF,10%,0201,10V  C_0201  [C0201]
C107  10nF,10%,0201,10V  C_0201  [C0201]
C108  1uF,20%,0201,6.3V  C_0201  [C0201]
C109  1uF,20%,0201,6.3V  C_0201  [C0201]
C110  1nF,10%,0201,25V  C_0201  [C0201]
C111  1uF,20%,0201,6.3V  C_0201  [C0201]
C112  10nF,10%,0201,10V  C_0201  [C0201]
C113  1uF,20%,0201,6.3V  C_0201  [C0201]
C114  1nF,10%,0201,25V  C_0201  [C0201]
C115  10nF,10%,0201,10V  C_0201  [C0201]
C116  1uF,20%,0201,6.3V  C_0201  [C0201]
C117  1uF,20%,0201,6.3V  C_0201  [C0201]
C118  1nF,10%,0201,25V  C_0201  [C0201]
C119  1nF,10%,0201,25V  C_0201  [C0201]
C120  1uF,20%,0201,6.3V  C_0201  [C0201]
C121  1uF,20%,0201,6.3V  C_0201  [C0201]
C122  1nF,10%,0201,25V  C_0201  [C0201]
C123  1uF,20%,0201,6.3V  C_0201  [C0201]
C124  1nF,10%,0201,25V  C_0201  [C0201]
C125  100nF,10%,0201,16V  C_0201  [C0201]
C126  1nF,10%,0201,25V  C_0201  [C0201]
C127  1uF,20%,0201,6.3V  C_0201  [C0201]
C128  1uF,20%,0201,6.3V  C_0201  [C0201]
C129  100nF,10%,0201,16V  C_0201  [C0201]
C130  1nF,10%,0201,25V  C_0201  [C0201]
C131  1uF,20%,0201,6.3V  C_0201  [C0201]
C132  10nF,10%,0201,10V  C_0201  [C0201]
C133  100nF,10%,0201,16V  C_0201  [C0201]
C134  10pF,5%,0201,50V  C_0201  [C0201]
C135  1uF,20%,0201,6.3V  C_0201  [C0201]
C136  100nF,10%,0201,16V  C_0201  [C0201]
C137  100nF,10%,0201,16V  C_0201  [C0201]
C138  10pF,5%,0201,50V  C_0201  [C0201]
C139  1uF,20%,0201,6.3V  C_0201  [C0201]
C140  1uF,20%,0201,6.3V  C_0201  [C0201]
C141  100nF,10%,0201,16V  C_0201  [C0201]
C142  10pF,5%,0201,50V  C_0201  [C0201]
C143  10nF,10%,0201,10V  C_0201  [C0201]
C144  10nF,10%,0201,10V  C_0201  [C0201]
C145  100nF,10%,0201,16V  C_0201  [C0201]
C146  10pF,5%,0201,50V  C_0201  [C0201]
C147  1nF,10%,0201,25V  C_0201  [C0201]
C148  100nF,10%,0201,16V  C_0201  [C0201]
C149  10pF,5%,0201,50V  C_0201  [C0201]
C150  1nF,10%,0201,25V  C_0201  [C0201]
C151  100nF,10%,0201,16V  C_0201  [C0201]
C152  100nF,10%,0201,16V  C_0201  [C0201]
C153  100nF,10%,0201,16V  C_0201  [C0201]
C154  2.2uF,10%,0402,16V  C_0402  [C0402]
C155  1nF,10%,0201,25V  C_0201  [C0201]
C156  100nF,10%,0201,16V  C_0201  [C0201]
C157  100nF,10%,0201,16V  C_0201  [C0201]
C158  10nF,10%,0201,10V  C_0201  [C0201]
C159  10nF,10%,0201,10V  C_0201  [C0201]
C160  100nF,10%,0201,16V  C_0201  [C0201]
C161  2.2uF,10%,0402,16V  C_0402  [C0402]
C162  1uF,20%,0201,6.3V  C_0201  [C0201]
C163  10nF,10%,0201,10V  C_0201  [C0201]
C164  100nF,10%,0201,16V  C_0201  [C0201]
C165  10pF,5%,0201,50V  C_0201  [C0201]
C166  10nF,10%,0201,10V  C_0201  [C0201]
C167  10nF,10%,0201,10V  C_0201  [C0201]
C168  100nF,10%,0201,16V  C_0201  [C0201]
C169  10pF,5%,0201,50V  C_0201  [C0201]
C170  1uF,20%,0201,6.3V  C_0201  [C0201]
C171  1uF,20%,0201,6.3V  C_0201  [C0201]
C172  100nF,10%,0201,16V  C_0201  [C0201]
C173  10pF,5%,0201,50V  C_0201  [C0201]
C174  10nF,10%,0201,10V  C_0201  [C0201]
C175  1uF,20%,0201,6.3V  C_0201  [C0201]
C176  100nF,10%,0201,16V  C_0201  [C0201]
C177  10pF,5%,0201,50V  C_0201  [C0201]
C178  1uF,20%,0201,6.3V  C_0201  [C0201]
C179  1nF,10%,0201,25V  C_0201  [C0201]
C180  1uF,20%,0201,6.3V  C_0201  [C0201]
C181  10pF,5%,0201,50V  C_0201  [C0201]
C182  10nF,10%,0201,10V  C_0201  [C0201]
C183  10nF,10%,0201,10V  C_0201  [C0201]
C184  1uF,20%,0201,6.3V  C_0201  [C0201]
C185  1nF,10%,0201,25V  C_0201  [C0201]
C186  1uF,20%,0201,6.3V  C_0201  [C0201]
C187  1uF,20%,0201,6.3V  C_0201  [C0201]
C188  1uF,20%,0201,6.3V  C_0201  [C0201]
C189  1nF,10%,0201,25V  C_0201  [C0201]
C190  10nF,10%,0201,10V  C_0201  [C0201]
C191  10nF,10%,0201,10V  C_0201  [C0201]
C192  1uF,20%,0201,6.3V  C_0201  [C0201]
C193  1nF,10%,0201,25V  C_0201  [C0201]
C194  1uF,20%,0201,6.3V  C_0201  [C0201]
C195  1uF,20%,0201,6.3V  C_0201  [C0201]
C196  1uF,20%,0201,6.3V  C_0201  [C0201]
C197  1nF,10%,0201,25V  C_0201  [C0201]
C198  10nF,10%,0201,10V  C_0201  [C0201]
C199  100nF,10%,0201,16V  C_0201  [C0201]
C200  1uF,20%,0201,6.3V  C_0201  [C0201]
C201  1nF,10%,0201,25V  C_0201  [C0201]
C202  1uF,20%,0201,6.3V  C_0201  [C0201]
C203  100nF,10%,0201,16V  C_0201  [C0201]
C204  22uF,20%,0603,6.3V  C_0603  [C0603]
C205  1nF,10%,0201,25V  C_0201  [C0201]
C206  1nF,10%,0201,25V  C_0201  [C0201]
C207  2.2uF,10%,0402,16V  C_0402  [C0402]
C208  22uF,20%,0603,6.3V  C_0603  [C0603]
C209  10nF,10%,0201,10V  C_0201  [C0201]
C210  1nF,10%,0201,25V  C_0201  [C0201]
C211  100nF,10%,0201,16V  C_0201  [C0201]
C212  22uF,20%,0603,6.3V  C_0603  [C0603]
C213  10nF,10%,0201,10V  C_0201  [C0201]
C214  10nF,10%,0201,10V  C_0201  [C0201]
C215  100nF,10%,0201,16V  C_0201  [C0201]
C216  10nF,10%,0201,10V  C_0201  [C0201]
C217  10nF,10%,0201,10V  C_0201  [C0201]
C218  2.2uF,10%,0402,16V  C_0402  [C0402]
C219  10nF,10%,0201,10V  C_0201  [C0201]
C220  10nF,10%,0201,10V  C_0201  [C0201]
C221  10nF,10%,0201,10V  C_0201  [C0201]
C222  10nF,10%,0201,10V  C_0201  [C0201]
C223  1uF,20%,0201,6.3V  C_0201  [C0201]
C224  1uF,20%,0201,6.3V  C_0201  [C0201]
C225  10nF,10%,0201,10V  C_0201  [C0201]
C226  1uF,20%,0201,6.3V  C_0201  [C0201]
C227  100nF,10%,0201,16V  C_0201  [C0201]
C228  10nF,10%,0201,10V  C_0201  [C0201]
C229  1uF,20%,0201,6.3V  C_0201  [C0201]
C230  1uF,20%,0201,6.3V  C_0201  [C0201]
C231  10nF,10%,0201,10V  C_0201  [C0201]
C232  1uF,20%,0201,6.3V  C_0201  [C0201]
C233  100nF,10%,0201,16V  C_0201  [C0201]
C234  10nF,10%,0201,10V  C_0201  [C0201]
C235  1nF,10%,0201,25V  C_0201  [C0201]
C236  1uF,20%,0201,6.3V  C_0201  [C0201]
C237  10nF,10%,0201,10V  C_0201  [C0201]
C238  10nF,10%,0201,10V  C_0201  [C0201]
C239  10nF,10%,0201,10V  C_0201  [C0201]
C240  1uF,20%,0201,6.3V  C_0201  [C0201]
C241  10nF,10%,0201,10V  C_0201  [C0201]
C242  1uF,20%,0201,6.3V  C_0201  [C0201]
C243  10nF,10%,0201,10V  C_0201  [C0201]
C244  1uF,20%,0201,6.3V  C_0201  [C0201]
C245  10nF,10%,0201,10V  C_0201  [C0201]
C246  1uF,20%,0201,6.3V  C_0201  [C0201]
C247  10nF,10%,0201,10V  C_0201  [C0201]
IC10  S32E288ABCAAMJGT  S32E288AACAAMJGR  [IC_S32E288AACAAMJGR]
L5  MPZ1608Y101BTD25  [L0603]
L6  MPZ1608Y101BTD25  [L0603]
L7  MPZ1608Y101BTD25  [L0603]
L8  MPZ1608Y101BTD25  [L0603]
R52  NOPOP  R_0402  [R0402]
R53  10K,1%,0402  R_0402  [R0402]
TP2  NOPOP  TEST-POINT2  [PAD.02X.02]

### Nets
+0V825: C64.1 C65.1 C68.1 C71.1 C73.1 C75.1 C77.1 C80.1 C83.1 C86.1 C89.2 C90.1 C93.2 C94.1 C97.2 C98.1 C101.1 C102.1 C105.1 C106.1 C109.1 C110.1 C113.1 C114.1 C117.1 C118.1 C121.1 C122.1 C125.1 C126.1 C129.1 C130.1 C133.1 C134.1 C137.1 C138.1 C140.1 C141.1 C142.1 C144.1 C145.1 C146.1 C148.1 C149.1 C153.1 C156.1 C160.1 C164.1 C165.1 C168.1 C169.1 C172.1 C173.1 C176.1 C177.1 C180.1 C181.1 C184.1 C185.1 C188.1 C189.1 C192.1 C193.1 C196.1 C197.1 C200.1 C201.1 C204.2 C205.1 C208.2 C209.1 C212.2 C213.1 C216.1 C219.1 C222.1 C225.1 C228.1 C231.1 C234.1 C237.1 C239.1 C241.1 C243.1 C245.1 C247.1 IC10.AA11(F:VDD) IC10.AA12(F:VDD) IC10.AA13(F:VDD) IC10.AA14(F:VDD) IC10.AA15(F:VDD) IC10.AA18(F:VDD) IC10.AA19(F:VDD) IC10.AA20(F:VDD) IC10.K9(F:VDD) IC10.K10(F:VDD) IC10.K11(F:VDD) IC10.K12(F:VDD) IC10.K13(F:VDD) IC10.K14(F:VDD) IC10.K15(F:VDD) IC10.K16(F:VDD) IC10.K17(F:VDD) IC10.K18(F:VDD) IC10.K19(F:VDD) IC10.K20(F:VDD) IC10.K21(F:VDD) IC10.K22(F:VDD) IC10.K23(F:VDD) IC10.L10(F:VDD) IC10.L11(F:VDD) IC10.L12(F:VDD) IC10.L13(F:VDD) IC10.L14(F:VDD) IC10.L15(F:VDD) IC10.L16(F:VDD) IC10.L17(F:VDD) IC10.L18(F:VDD) IC10.L19(F:VDD) IC10.L20(F:VDD) IC10.L21(F:VDD) IC10.L22(F:VDD) IC10.L23(F:VDD) IC10.M10(F:VDD) IC10.M11(F:VDD) IC10.M22(F:VDD) IC10.M23(F:VDD) IC10.N22(F:VDD) IC10.N23(F:VDD) IC10.P8(H:VDD_LV_PLL_AUR) IC10.P10(F:VDD) IC10.P22(F:VDD) IC10.P23(F:VDD) IC10.R8(H:VDD_LV_PLL_AUR) IC10.R10(F:VDD) IC10.R11(F:VDD) IC10.R22(F:VDD) IC10.R23(F:VDD) IC10.T10(F:VDD) IC10.T11(F:VDD) IC10.T22(F:VDD) IC10.T23(F:VDD) IC10.U10(F:VDD) IC10.U11(F:VDD) IC10.U22(F:VDD) IC10.U23(F:VDD) IC10.V10(F:VDD) IC10.V11(F:VDD) IC10.V22(F:VDD) IC10.V23(F:VDD) IC10.W10(F:VDD) IC10.W11(F:VDD) IC10.W22(F:VDD) IC10.W23(F:VDD) IC10.Y10(F:VDD) IC10.Y11(F:VDD) IC10.Y12(F:VDD) IC10.Y13(F:VDD) IC10.Y14(F:VDD) IC10.Y15(F:VDD) IC10.Y16(F:VDD) IC10.Y17(F:VDD) IC10.Y18(F:VDD) IC10.Y19(F:VDD) IC10.Y20(F:VDD) IC10.Y21(F:VDD) IC10.Y22(F:VDD) IC10.Y23(F:VDD) ; also sheet 2,4
+1V1: C206.1 C210.1 C214.1 C217.1 C220.1 C223.1 C226.1 C229.1 C232.1 IC10.M25(G:VDD_IO_DDR0) IC10.M27(G:VDD_IO_DDR0) IC10.M28(G:VDD_IO_DDR0) IC10.N25(G:VDD_IO_DDR0) IC10.N27(G:VDD_IO_DDR0) IC10.P25(G:VDD_IO_DDR0) IC10.P27(G:VDD_IO_DDR0) IC10.R25(G:VDD_IO_DDR0) IC10.R27(G:VDD_IO_DDR0) IC10.T25(G:VDD_IO_DDR0) IC10.T27(G:VDD_IO_DDR0) IC10.U25(G:VDD_IO_DDR0) IC10.U27(G:VDD_IO_DDR0) IC10.U28(G:VDD_IO_DDR0) ; also sheet 2,4,6
+1V8: C66.1 C69.1 C72.1 C74.1 C76.1 C84.1 C92.1 C96.1 C99.1 C100.1 C103.1 C104.1 C107.1 C108.1 C112.1 C116.1 C120.1 C124.1 C128.1 C132.1 C136.1 C159.1 C163.1 C166.1 C167.1 C170.1 C171.1 C174.1 C175.1 C178.1 C179.1 C183.1 C187.1 C190.1 C191.1 C194.1 C195.1 C198.1 C202.1 C221.1 C224.1 IC10.AA9(G:VDD_ANA) IC10.AA10(G:VDD_ANA) IC10.AA21(H:VDD_HV_REG) IC10.AA22(H:VDD_HV_REG) IC10.AB6(G:VDD_ANA) IC10.AB7(G:VDD_ANA) IC10.AC1(H:VREFH_ADC_1) IC10.AD2(H:VREFH_ADC_1) IC10.AE1(H:VREFH_ADC_0) IC10.AF2(H:VREFH_ADC_0) IC10.D14(H:VCC_FLASH) IC10.D16(H:VCCQ_FLASH) IC10.E14(H:VCC_FLASH) IC10.E16(H:VCCQ_FLASH) IC10.F3(G:VDD_IO_AUR) IC10.G7(H:VDD_HV_IO_LFAST) IC10.G10(G:VDD_IO_ETH_1) IC10.G11(G:VDD_IO_ETH_1) IC10.G13(G:VDD_IO_ETH_0) IC10.G14(G:VDD_IO_ETH_0) IC10.H6(H:VDD_HV_IO_LFAST) IC10.H7(H:VDD_HV_IO_LFAST) IC10.H8(H:VDD_HV_IO_LFAST) IC10.H10(G:VDD_IO_ETH_1) IC10.H11(G:VDD_IO_ETH_1) IC10.H13(G:VDD_IO_ETH_0) IC10.H14(G:VDD_IO_ETH_0) IC10.H18(G:VDD_IO_QSPI_0) IC10.H19(G:VDD_IO_QSPI_0) IC10.J3(G:VDD_IO_AUR) IC10.J6(H:VDD_HV_IO_LFAST) IC10.L6(H:VDD_HV_LFASTPLL_1) IC10.L8(H:VDD_HV_LFASTPLL_0) IC10.M3(G:VDD_IO_AUR) IC10.M6(H:VDD_HV_LFASTPLL_1) IC10.M8(H:VDD_HV_LFASTPLL_0) IC10.N6(H:VDD_HV_FXOSC_PLL) IC10.N8(H:VDD_HV_PLL_AUR) IC10.N9(H:VDD_HV_PLL_AUR) IC10.P6(H:VDD_HV_FXOSC_PLL) IC10.R28(G:VDD_DDR0) IC10.T8(G:VDD_FIRC) IC10.T28(G:VDD_DDR0) IC10.U8(G:VDD_FIRC) IC10.V7(G:VDD_ANA) IC10.V26(H:VDD_HV_PLL_DDR0) IC10.W6(G:VDD_ANA) IC10.W8(G:VDD_IO_MSC) IC10.W9(G:VDD_IO_MSC) IC10.W26(H:VDD_HV_PLL_DDR0) R52.2 ; also sheet 2,4,5,6
+3V3: C67.1 C70.1 C87.1 C91.1 C95.1 C111.1 C115.1 C119.1 C123.1 C127.1 C131.1 C135.1 C139.1 C143.1 C147.1 C150.1 C152.1 C154.1 C155.1 C157.1 C158.1 C161.1 C162.1 C182.1 C186.1 C199.1 C203.1 C207.1 C211.1 C215.1 C218.1 C235.1 C238.1 C240.1 C242.1 C244.1 C246.1 IC10.AA16(G:VDD_IO_EIG) IC10.AA17(G:VDD_IO_EIG) IC10.AA25(G:VDD_IO_A_J_POR) IC10.AB18(F:VDD33) IC10.AB19(F:VDD33) IC10.AB22(F:VDD33) IC10.AB23(F:VDD33) IC10.AC8(G:VDD_IO_EIG) IC10.AC9(G:VDD_IO_EIG) IC10.AC11(G:VDD_IO_EIG) IC10.AC12(G:VDD_IO_EIG) IC10.AC13(G:VDD_IO_EIG) IC10.AC14(H:VDD_HV_IO_D2) IC10.AC15(H:VDD_HV_IO_D2) IC10.AC16(H:VDD_HV_IO_D2) IC10.AC24(H:VDD_HV_IO_D1) IC10.AD7(G:VDD_IO_EIG) IC10.AD8(G:VDD_IO_EIG) IC10.AD11(G:VDD_IO_EIG) IC10.AD16(H:VDD_HV_IO_D2) IC10.AD24(H:VDD_HV_IO_D1) IC10.AJ20(F:VDDA) IC10.AJ21(F:VDDA) IC10.G16(G:VDD_IO_BF) IC10.G17(G:VDD_IO_BF) IC10.G20(G:VDD_IO_BF) IC10.G21(G:VDD_IO_BF) IC10.G23(G:VDD_IO_QSPI_1) IC10.G24(G:VDD_IO_QSPI_1) IC10.H16(G:VDD_IO_BF) IC10.H22(G:VDD_IO_QSPI_1) IC10.H25(G:VDD_IO_H) IC10.H26(G:VDD_IO_H) IC10.H27(G:VDD_IO_H) IC10.N11(G:VDD_IO_CD) IC10.P11(G:VDD_IO_CD) IC10.T6(G:VDD_IO_CD) IC10.U6(G:VDD_IO_CD) IC10.W28(G:VDD_IO_A_J_POR) IC10.Y25(G:VDD_IO_A_J_POR) IC10.Y27(G:VDD_IO_A_J_POR) L5.1 L6.1 L7.1 L8.1 ; also sheet 2,4,5,7,8,9
GND: C64.2 C65.2 C66.2 C67.2 C68.2 C69.2 C70.2 C71.2 C72.2 C73.2 C74.2 C75.2 C76.2 C77.2 C78.2 C79.2 C80.2 C81.2 C82.2 C83.2 C84.2 C85.2 C86.2 C87.2 C88.2 C89.1 C90.2 C91.2 C92.2 C93.1 C94.2 C95.2 C96.2 C97.1 C98.2 C99.2 C100.2 C101.2 C102.2 C103.2 C104.2 C105.2 C106.2 C107.2 C108.2 C109.2 C110.2 C111.2 C112.2 C113.2 C114.2 C115.2 C116.2 C117.2 C118.2 C119.2 C120.2 C121.2 C122.2 C123.2 C124.2 C125.2 C126.2 C127.2 C128.2 C129.2 C130.2 C131.2 C132.2 C133.2 C134.2 C135.2 C136.2 C137.2 C138.2 C139.2 C140.2 C141.2 C142.2 C143.2 C144.2 C145.2 C146.2 C147.2 C148.2 C149.2 C150.2 C151.2 C152.2 C153.2 C154.2 C155.2 C156.2 C157.2 C158.2 C159.2 C160.2 C161.2 C162.2 C163.2 C164.2 C165.2 C166.2 C167.2 C168.2 C169.2 C170.2 C171.2 C172.2 C173.2 C174.2 C175.2 C176.2 C177.2 C178.2 C179.2 C180.2 C181.2 C182.2 C183.2 C184.2 C185.2 C186.2 C187.2 C188.2 C189.2 C190.2 C191.2 C192.2 C193.2 C194.2 C195.2 C196.2 C197.2 C198.2 C199.2 C200.2 C201.2 C202.2 C203.2 C204.1 C205.2 C206.2 C207.2 C208.1 C209.2 C210.2 C211.2 C212.1 C213.2 C214.2 C215.2 C216.2 C217.2 C218.2 C219.2 C220.2 C221.2 C222.2 C223.2 C224.2 C225.2 C226.2 C227.2 C228.2 C229.2 C230.2 C231.2 C232.2 C233.2 C234.2 C235.2 C236.2 C237.2 C238.2 C239.2 C240.2 C241.2 C242.2 C243.2 C244.2 C245.2 C246.2 C247.2 IC10.A2(I:VSS) IC10.A31(I:VSS) IC10.AA1(K:VSS) IC10.AA2(K:VSS) IC10.AA3(K:VSS) IC10.AA6(H:VSS_ADC) IC10.AA8(H:VSS_ADC) IC10.AA24(K:VSS) IC10.AA26(K:VSS) IC10.AA27(K:VSS) IC10.AA28(K:VSS) IC10.AA29(K:VSS) IC10.AA30(K:VSS) IC10.AA31(K:VSS) IC10.AB2(H:VREFL_ADC_1) IC10.AB3(K:VSS) IC10.AB4(K:VSS) IC10.AB5(K:VSS) IC10.AB9(K:VSS) IC10.AB11(K:VSS) IC10.AB13(K:VSS) IC10.AB15(K:VSS) IC10.AB17(K:VSS) IC10.AB20(K:VSS) IC10.AB21(K:VSS) IC10.AB25(K:VSS) IC10.AB30(K:VSS) IC10.AC3(K:VSS) IC10.AC6(K:VSS) IC10.AC7(K:VSS) IC10.AC10(K:VSS) IC10.AC19(K:VSS) IC10.AC20(K:VSS) IC10.AC21(K:VSS) IC10.AC22(K:VSS) IC10.AC23(K:VSS) IC10.AC30(K:VSS) IC10.AD3(K:VSS) IC10.AD6(K:VSS) IC10.AD9(K:VSS) IC10.AD12(K:VSS) IC10.AD15(K:VSS) IC10.AD17(L:VSS) IC10.AD19(L:VSS) IC10.AD20(L:VSS) IC10.AD21(L:VSS) IC10.AD22(L:VSS) IC10.AD23(L:VSS) IC10.AD25(L:VSS) IC10.AD26(L:VSS) IC10.AD27(L:VSS) IC10.AD28(L:VSS) IC10.AD29(L:VSS) IC10.AD30(L:VSS) IC10.AE3(L:VSS) IC10.AE4(L:VSS) IC10.AE5(L:VSS) IC10.AE9(L:VSS) IC10.AE12(L:VSS) IC10.AE15(L:VSS) IC10.AE19(L:VSS) IC10.AE20(L:VSS) IC10.AE21(L:VSS) IC10.AE22(L:VSS) IC10.AE23(L:VSS) IC10.AE30(L:VSS) IC10.AF3(L:VSS) IC10.AF9(L:VSS) IC10.AF12(L:VSS) IC10.AF15(L:VSS) IC10.AF17(L:VSS) IC10.AF18(H:SAR2_VRL_IO) IC10.AF19(L:VSS) IC10.AF20(L:VSS) IC10.AF21(L:VSS) IC10.AF22(L:VSS) IC10.AF23(L:VSS) IC10.AF25(H:SAR01_VRL) IC10.AF26(L:VSS) IC10.AF30(L:VSS) IC10.AG1(H:VREFL_ADC_0) IC10.AG3(L:VSS) IC10.AG4(L:VSS) IC10.AG5(L:VSS) IC10.AG6(L:VSS) IC10.AG9(L:VSS) IC10.AG12(L:VSS) IC10.AG15(L:VSS) IC10.AG16(L:VSS) IC10.AG18(H:SAR2_VRL_IO) IC10.AG19(L:VSS) IC10.AG20(L:VSS) IC10.AG21(H:VSSA) IC10.AG22(L:VSS) IC10.AG23(L:VSS) IC10.AG26(H:SAR01_VRL) IC10.AG27(L:VSS) IC10.AG28(L:VSS) IC10.AG29(L:VSS) IC10.AG30(L:VSS) IC10.AH1(L:VSS) IC10.AH2(L:VSS) IC10.AH3(L:VSS) IC10.AH6(L:VSS) IC10.AH9(L:VSS) IC10.AH12(L:VSS) IC10.AH15(L:VSS) IC10.AH17(L:VSS) IC10.AH19(L:VSS) IC10.AH20(L:VSS) IC10.AH21(H:VSSA) IC10.AH22(L:VSS) IC10.AH23(H:SAR01_VRL_IO) IC10.AH25(L:VSS) IC10.AH26(L:VSS) IC10.AH30(L:VSS) IC10.AJ3(L:VSS) IC10.AJ6(L:VSS) IC10.AJ9(L:VSS) IC10.AJ12(L:VSS) IC10.AJ15(L:VSS) IC10.AJ16(H:SAR2_VRL) IC10.AJ23(H:SAR01_VRL_IO) IC10.AJ30(L:VSS) IC10.AK3(L:VSS) IC10.AK4(L:VSS) IC10.AK5(L:VSS) IC10.AK6(L:VSS) IC10.AK7(L:VSS) IC10.AK8(L:VSS) IC10.AK9(L:VSS) IC10.AK10(L:VSS) IC10.AK11(L:VSS) IC10.AK12(L:VSS) IC10.AK13(L:VSS) IC10.AK14(L:VSS) IC10.AK15(L:VSS) IC10.AK16(L:VSS) IC10.AK17(L:VSS) IC10.AK19(L:VSS) IC10.AK21(L:VSS) IC10.AK23(L:VSS) IC10.AK25(L:VSS) IC10.AK26(L:VSS) IC10.AK27(L:VSS) IC10.AK28(L:VSS) IC10.AK29(L:VSS) IC10.AL1(L:VSS) IC10.AL32(L:VSS) IC10.AM2(L:VSS) IC10.AM31(L:VSS) IC10.B1(I:VSS) IC10.B32(I:VSS) IC10.C3(I:VSS) IC10.C4(I:VSS) IC10.C5(I:VSS) IC10.C6(I:VSS) IC10.C7(I:VSS) IC10.C8(I:VSS) IC10.C9(I:VSS) IC10.C10(I:VSS) IC10.C11(I:VSS) IC10.C12(I:VSS) IC10.C13(I:VSS) IC10.C14(I:VSS) IC10.C15(I:VSS) IC10.C16(I:VSS) IC10.C17(I:VSS) IC10.C18(I:VSS) IC10.C19(I:VSS) IC10.C20(I:VSS) IC10.C21(I:VSS) IC10.C22(I:VSS) IC10.C23(I:VSS) IC10.C24(I:VSS) IC10.C25(I:VSS) IC10.C26(I:VSS) IC10.C27(I:VSS) IC10.C28(I:VSS) IC10.C29(I:VSS) IC10.D3(I:VSS) IC10.D6(I:VSS) IC10.D9(I:VSS) IC10.D12(I:VSS) IC10.D15(I:VSS) IC10.D18(I:VSS) IC10.D21(I:VSS) IC10.D24(I:VSS) IC10.D27(I:VSS) IC10.D30(I:VSS) IC10.E3(I:VSS) IC10.E6(I:VSS) IC10.E9(I:VSS) IC10.E12(I:VSS) IC10.E15(I:VSS) IC10.E18(I:VSS) IC10.E21(I:VSS) IC10.E24(I:VSS) IC10.E27(I:VSS) IC10.E30(I:VSS) IC10.F1(I:VSS) IC10.F2(I:VSS) IC10.F4(I:VSS) IC10.F5(I:VSS) IC10.F6(I:VSS) IC10.F7(I:VSS) IC10.F9(I:VSS) IC10.F12(I:VSS) IC10.F15(I:VSS) IC10.F18(I:VSS) IC10.F21(I:VSS) IC10.F24(I:VSS) IC10.F27(I:VSS) IC10.F28(I:VSS) IC10.F29(I:VSS) IC10.F30(I:VSS) IC10.F31(I:VSS) IC10.G3(I:VSS) IC10.G8(I:VSS) IC10.G9(I:VSS) IC10.G12(I:VSS) IC10.G15(I:VSS) IC10.G18(I:VSS) IC10.G19(I:VSS) IC10.G22(I:VSS) IC10.G25(I:VSS) IC10.G26(I:VSS) IC10.G27(I:VSS) IC10.G29(I:VSS) IC10.H3(I:VSS) IC10.H9(I:VSS) IC10.H12(I:VSS) IC10.H15(I:VSS) IC10.H17(I:VSS) IC10.H20(I:VSS) IC10.H21(I:VSS) IC10.H23(I:VSS) IC10.H24(I:VSS) IC10.H29(I:VSS) IC10.J1(I:VSS) IC10.J2(I:VSS) IC10.J8(I:VSS) IC10.J10(I:VSS) IC10.J12(I:VSS) IC10.J14(I:VSS) IC10.J16(I:VSS) IC10.J18(I:VSS) IC10.J20(I:VSS) IC10.J22(I:VSS) IC10.J24(J:VSS) IC10.J25(J:VSS) IC10.J26(J:VSS) IC10.J27(J:VSS) IC10.J28(J:VSS) IC10.J29(J:VSS) IC10.J30(J:VSS) IC10.J31(J:VSS) IC10.K3(J:VSS) IC10.K4(J:VSS) IC10.K5(J:VSS) IC10.K6(J:VSS) IC10.K7(J:VSS) IC10.K8(J:VSS) IC10.K28(J:VSS) IC10.L3(J:VSS) IC10.L9(J:VSS) IC10.L24(J:VSS) IC10.L25(J:VSS) IC10.L26(J:VSS) IC10.L27(J:VSS) IC10.L28(J:VSS) IC10.M1(J:VSS) IC10.M2(J:VSS) IC10.M4(J:VSS) IC10.M5(J:VSS) IC10.M7(J:VSS) IC10.M9(J:VSS) IC10.M12(J:VSS) IC10.M13(J:VSS) IC10.M14(J:VSS) IC10.M15(J:VSS) IC10.M16(J:VSS) IC10.M17(J:VSS) IC10.M18(J:VSS) IC10.M19(J:VSS) IC10.M20(J:VSS) IC10.M21(J:VSS) IC10.M26(J:VSS) IC10.M29(J:VSS) IC10.M30(J:VSS) IC10.M31(J:VSS) IC10.N3(J:VSS) IC10.N10(J:VSS) IC10.N12(J:VSS) IC10.N13(J:VSS) IC10.N14(J:VSS) IC10.N15(J:VSS) IC10.N16(J:VSS) IC10.N17(J:VSS) IC10.N18(J:VSS) IC10.N19(J:VSS) IC10.N20(J:VSS) IC10.N21(J:VSS) IC10.N24(J:VSS) IC10.N26(J:VSS) IC10.N28(J:VSS) IC10.P3(J:VSS) IC10.P4(J:VSS) IC10.P5(J:VSS) IC10.P7(J:VSS) IC10.P9(J:VSS) IC10.P12(J:VSS) IC10.P13(J:VSS) IC10.P14(J:VSS) IC10.P15(J:VSS) IC10.P16(J:VSS) IC10.P17(J:VSS) IC10.P18(J:VSS) IC10.P19(J:VSS) IC10.P20(J:VSS) IC10.P21(J:VSS) IC10.P26(J:VSS) IC10.R3(J:VSS) IC10.R6(J:VSS) IC10.R9(J:VSS) IC10.R12(J:VSS) IC10.R13(J:VSS) IC10.R14(J:VSS) IC10.R15(J:VSS) IC10.R16(J:VSS) IC10.R17(J:VSS) IC10.R18(J:VSS) IC10.R19(J:VSS) IC10.R20(J:VSS) IC10.R21(J:VSS) IC10.R24(J:VSS) IC10.R26(J:VSS) IC10.R29(J:VSS) IC10.R30(J:VSS) IC10.R31(J:VSS) IC10.T3(J:VSS) IC10.T7(J:VSS) IC10.T9(J:VSS) IC10.T12(J:VSS) IC10.T13(J:VSS) IC10.T14(J:VSS) IC10.T15(J:VSS) IC10.T16(J:VSS) IC10.T17(J:VSS) IC10.T18(K:VSS) IC10.T19(K:VSS) IC10.T20(K:VSS) IC10.T21(K:VSS) IC10.T26(K:VSS) IC10.U3(K:VSS) IC10.U9(K:VSS) IC10.U12(K:VSS) IC10.U13(K:VSS) IC10.U14(K:VSS) IC10.U15(K:VSS) IC10.U16(K:VSS) IC10.U17(K:VSS) IC10.U18(K:VSS) IC10.U19(K:VSS) IC10.U20(K:VSS) IC10.U21(K:VSS) IC10.U24(K:VSS) IC10.U26(K:VSS) IC10.V3(K:VSS) IC10.V4(K:VSS) IC10.V5(K:VSS) IC10.V6(K:VSS) IC10.V8(K:VSS) IC10.V9(K:VSS) IC10.V12(K:VSS) IC10.V13(K:VSS) IC10.V14(K:VSS) IC10.V15(K:VSS) IC10.V16(K:VSS) IC10.V17(K:VSS) IC10.V18(K:VSS) IC10.V19(K:VSS) IC10.V20(K:VSS) IC10.V21(K:VSS) IC10.V25(K:VSS) IC10.V27(K:VSS) IC10.V28(K:VSS) IC10.V29(K:VSS) IC10.V30(K:VSS) IC10.V31(K:VSS) IC10.W3(K:VSS) IC10.W12(K:VSS) IC10.W13(K:VSS) IC10.W14(K:VSS) IC10.W15(K:VSS) IC10.W16(K:VSS) IC10.W17(K:VSS) IC10.W18(K:VSS) IC10.W19(K:VSS) IC10.W20(K:VSS) IC10.W21(K:VSS) IC10.W24(K:VSS) IC10.W25(K:VSS) IC10.W27(K:VSS) IC10.W29(K:VSS) IC10.Y3(K:VSS) IC10.Y6(K:VSS) IC10.Y7(K:VSS) IC10.Y8(K:VSS) IC10.Y9(K:VSS) IC10.Y26(K:VSS) IC10.Y29(K:VSS) R53.1 ; also sheet 1,2,4,5,6,7,8,9
PMIC_SENSE: IC10.AC4(H:PMIC_SENSE) TP2.P$1
SAR01_VRH: C79.1 C82.1 IC10.AF24(H:SAR01_VRH) IC10.AG24(H:SAR01_VRH) L5.2
SAR01_VRH_IO: C85.1 C88.1 IC10.AH24(H:SAR01_VRH_IO) IC10.AJ24(H:SAR01_VRH_IO) L6.2
SAR2_VRH: C233.1 C236.1 IC10.AH16(H:SAR2_VRH) L7.2
SAR2_VRH_IO: C227.1 C230.1 IC10.AH18(H:SAR2_VRH_IO) IC10.AJ18(H:SAR2_VRH_IO) L8.2
VDD12: C151.1 IC10.AA23(F:VDD12) IC10.AC18(F:VDD12) IC10.AD18(F:VDD12) IC10.AE18(F:VDD12) IC10.AE24(F:VDD12) IC10.AJ19(F:VDD12) IC10.AJ22(F:VDD12)
VDD_EFUSE: C78.1 C81.1 IC10.K25(G:VDD_EFUSE) IC10.K26(G:VDD_EFUSE) IC10.K27(G:VDD_EFUSE) R52.1 R53.2

### Notes on the sheet
- S32 Power Supply
- 1.2A max
- 10mA
- 10mA
- 10mA
- 5mA | 0.8mA
- 140mA Not used | 56mA Not used
- <1mA | 56mA
- 2mA | 0.6mA
- 0.6mA Not used | 0.2mA
- 1.3mA | 35mA
- 1.9mA | 130mA
- 2mA
- 2mA | 2mA
- 2mA
- 0.5mA
- 16mA | 0.5mA
- <10mA | 15mA
- 5mA | 15mA
- 160mA | 2mA
- 10mA | 65uA
- 65uA
- BASIC/design/LM.sch
- hw_LM/BASIC
- 1010xx
- jcc5
- abs8